# EAGLE design BattleBits_V4 (EAGLE 9.6.2)
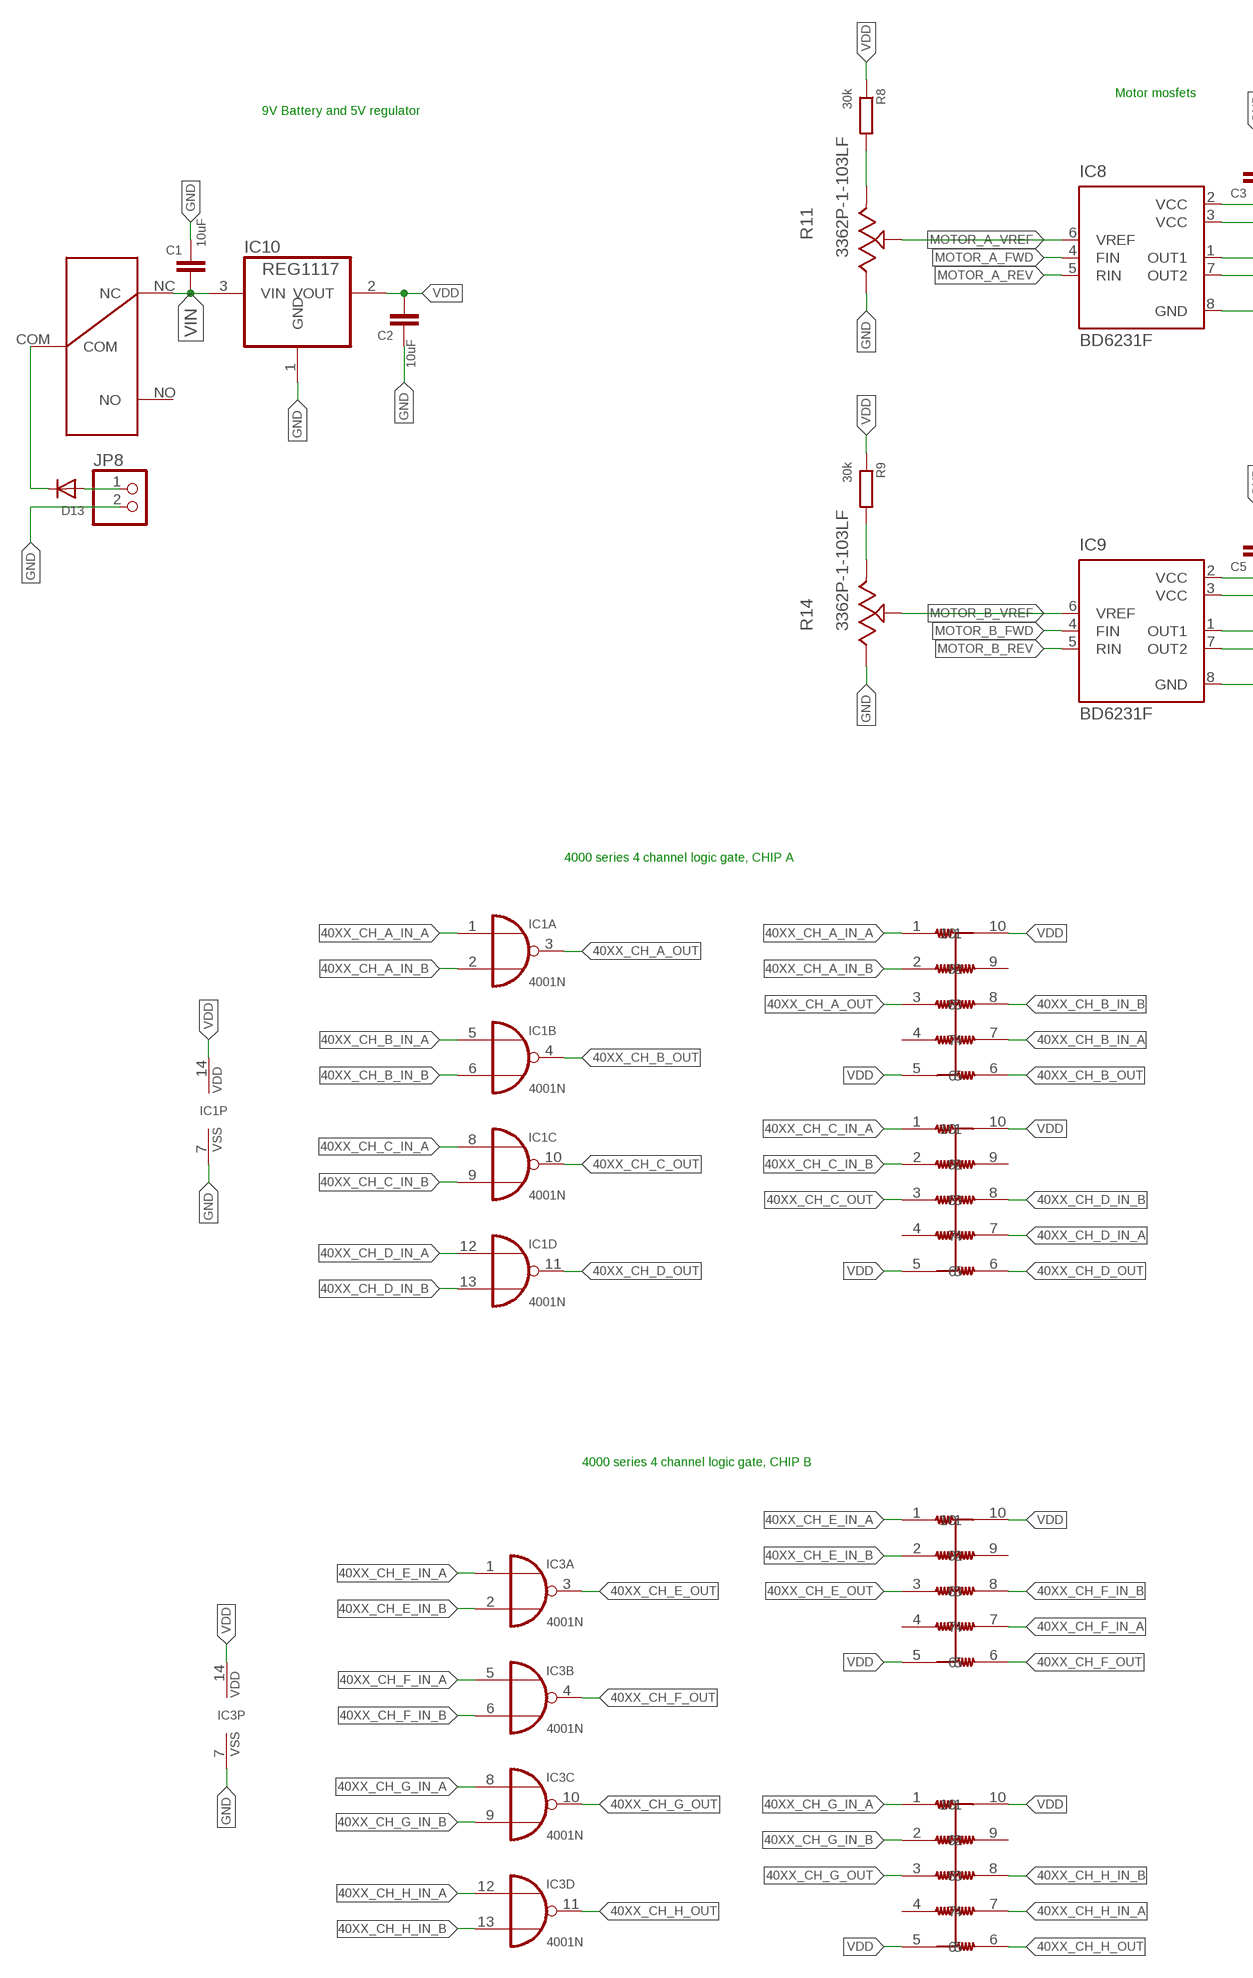
[diagram p0: schematic, sheet 1, part 1 of 2]
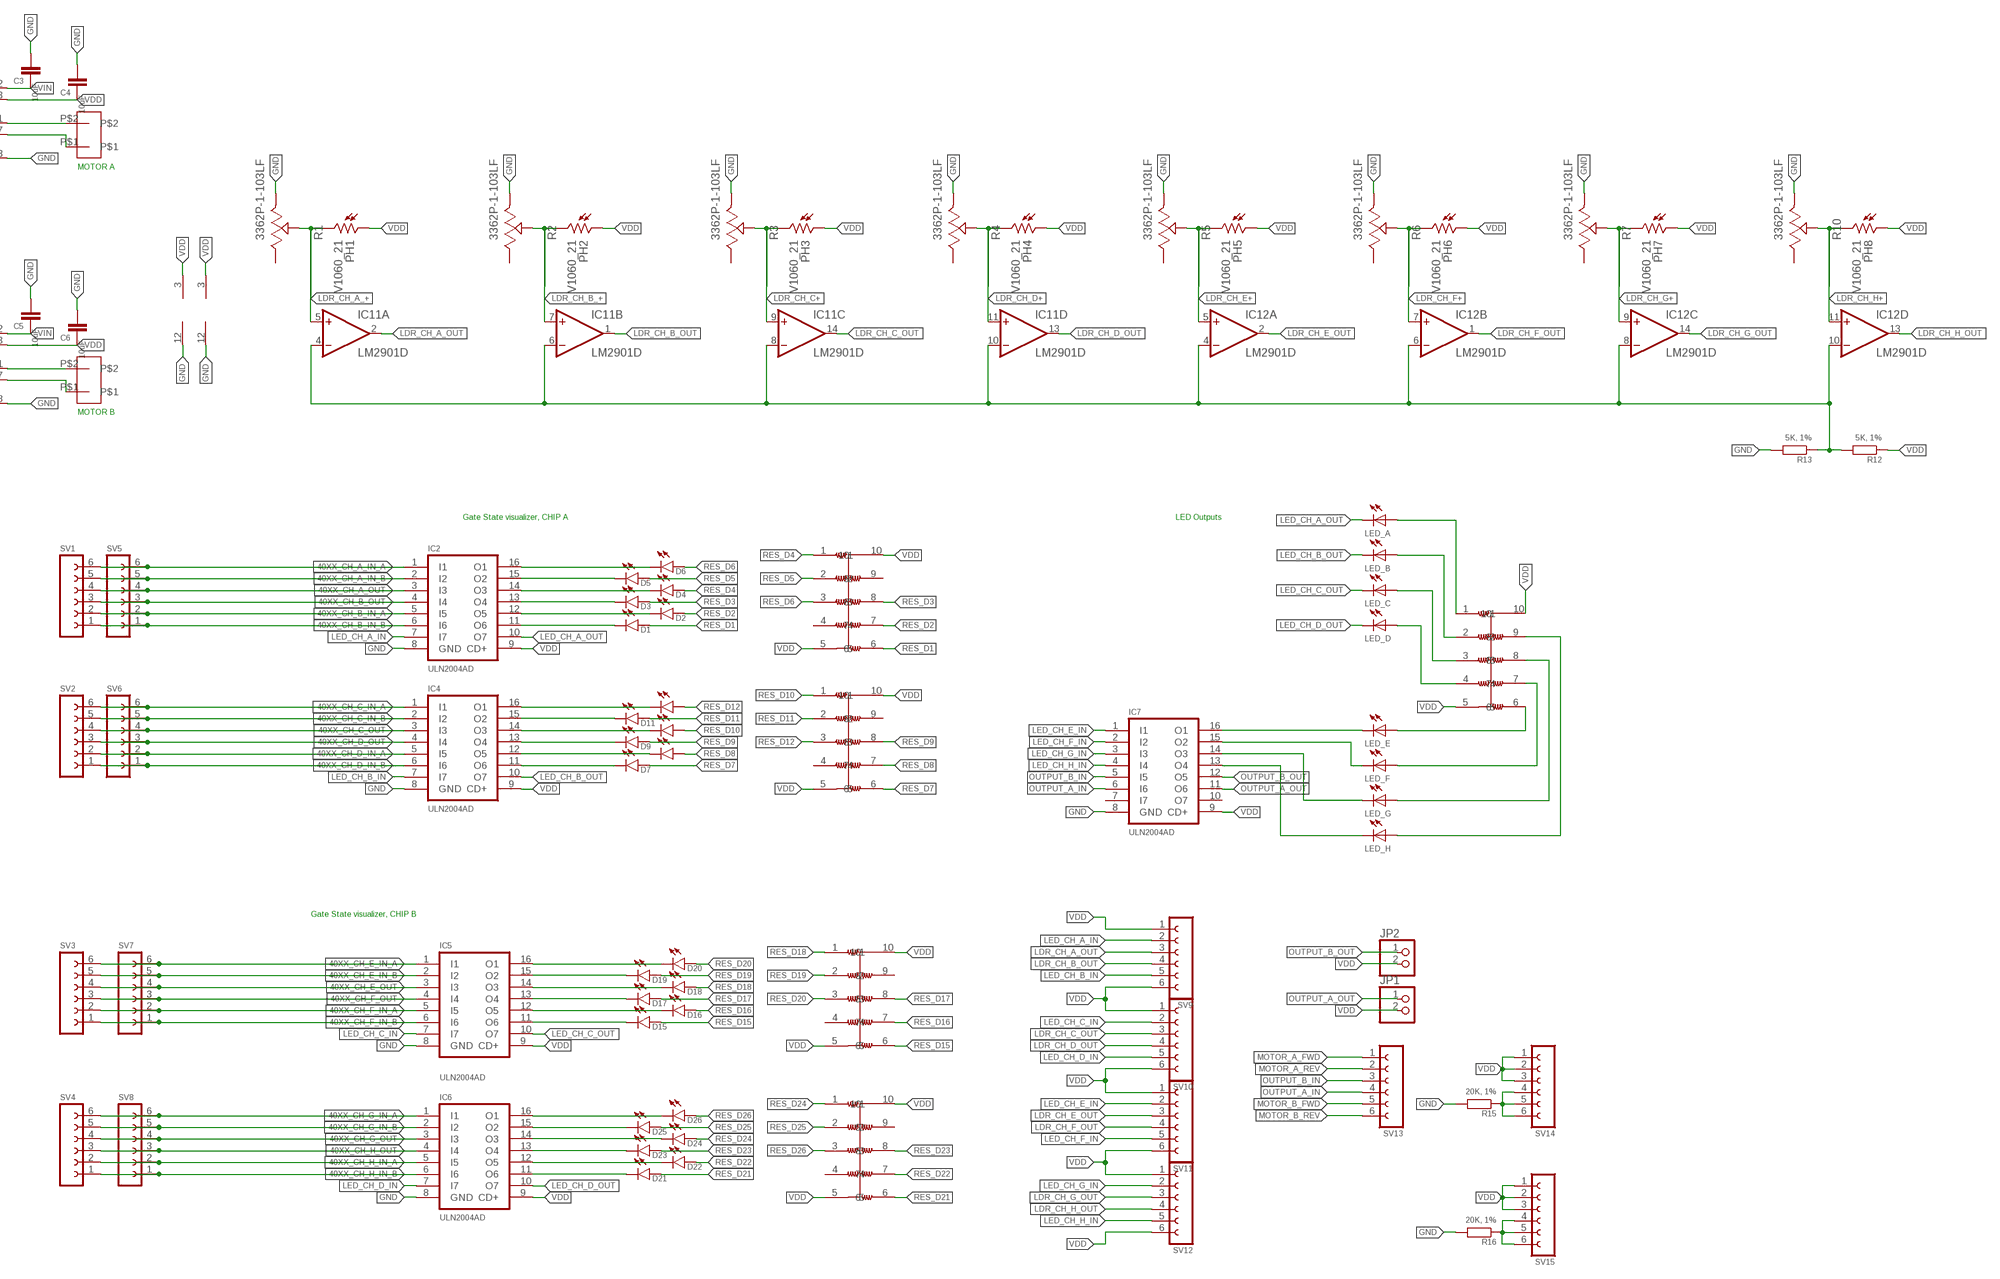
[diagram p1: schematic, sheet 1, part 2 of 2]

## Parts
C1  10uF  C-EUC3216  [C3216]
C2  10uF  C-EUC3216  [C3216]
C3  10uF  C-EUC3216  [C3216]
C4  10uF  C-EUC3216  [C3216]
C5  10uF  C-EUC3216  [C3216]
C6  10uF  C-EUC3216  [C3216]
D1  LED1206  [LED-1206]
D2  LED1206  [LED-1206]
D3  LED1206  [LED-1206]
D4  LED1206  [LED-1206]
D5  LED1206  [LED-1206]
D6  LED1206  [LED-1206]
D7  LED1206  [LED-1206]
D8  LED1206  [LED-1206]
D9  LED1206  [LED-1206]
D10  LED1206  [LED-1206]
D11  LED1206  [LED-1206]
D12  LED1206  [LED-1206]
D13  DIODESMA  [SMADIODE]
D15  LED1206  [LED-1206]
D16  LED1206  [LED-1206]
D17  LED1206  [LED-1206]
D18  LED1206  [LED-1206]
D19  LED1206  [LED-1206]
D20  LED1206  [LED-1206]
D21  LED1206  [LED-1206]
D22  LED1206  [LED-1206]
D23  LED1206  [LED-1206]
D24  LED1206  [LED-1206]
D25  LED1206  [LED-1206]
D26  LED1206  [LED-1206]
IC1  4001N  [DIL14]
IC2  ULN2004AD  [SO16]
IC3  4001N  [DIL14]
IC4  ULN2004AD  [SO16]
IC5  ULN2004AD  [SO16]
IC6  ULN2004AD  [SO16]
IC7  ULN2004AD  [SO16]
IC8  BD6231F  [SOP8]
IC9  BD6231F  [SOP8]
IC10  REG1117  [SOT223]
IC11  LM2901D  [SO14]
IC12  LM2901D  [SO14]
JP1  PINHD-1X2  [1X02]
JP2  PINHD-1X2  [1X02]
JP8  PINHD-1X2  [1X02]
LED_A  LED5MM  [LED5MM]
LED_B  LED5MM  [LED5MM]
LED_C  LED5MM  [LED5MM]
LED_D  LED5MM  [LED5MM]
LED_E  LED5MM  [LED5MM]
LED_F  LED5MM  [LED5MM]
LED_G  LED5MM  [LED5MM]
LED_H  LED5MM  [LED5MM]
PH1  V1060_21  [TO-5_V10]
PH2  V1060_21  [TO-5_V10]
PH3  V1060_21  [TO-5_V10]
PH4  V1060_21  [TO-5_V10]
PH5  V1060_21  [TO-5_V10]
PH6  V1060_21  [TO-5_V10]
PH7  V1060_21  [TO-5_V10]
PH8  V1060_21  [TO-5_V10]
R1  3362P-1-103LF  [3362P-1-103LF]
R2  3362P-1-103LF  [3362P-1-103LF]
R3  3362P-1-103LF  [3362P-1-103LF]
R4  3362P-1-103LF  [3362P-1-103LF]
R5  3362P-1-103LF  [3362P-1-103LF]
R6  3362P-1-103LF  [3362P-1-103LF]
R7  3362P-1-103LF  [3362P-1-103LF]
R8  30k  R-EU_R3216  [R3216]
R9  30k  R-EU_R3216  [R3216]
R10  3362P-1-103LF  [3362P-1-103LF]
R11  3362P-1-103LF  [3362P-1-103LF]
R12  5K, 1%  R-EU_R3216  [R3216]
R13  5K, 1%  R-EU_R3216  [R3216]
R14  3362P-1-103LF  [3362P-1-103LF]
R15  20K, 1%  R-EU_R3216  [R3216]
R16  20K, 1%  R-EU_R3216  [R3216]
SV1  FE06-1  [FE06]
SV2  FE06-1  [FE06]
SV3  FE06-1  [FE06]
SV4  FE06-1  [FE06]
SV5  FE06-1  [FE06]
SV6  FE06-1  [FE06]
SV7  FE06-1  [FE06]
SV8  FE06-1  [FE06]
SV9  FE06-1  [FE06]
SV10  FE06-1  [FE06]
SV11  FE06-1  [FE06]
SV12  FE06-1  [FE06]
SV13  FE06-1  [FE06]
SV14  FE06-1  [FE06]
SV15  FE06-1  [FE06]
U$1  MOTOR  [GEARMOTOR]
U$2  MOTOR  [GEARMOTOR]
U$3  10K  EXBA_10P  [EXBA]
U$4  330  EXBA_10P  [EXBA]
U$5  10K  EXBA_10P  [EXBA]
U$6  10K  EXBA_10P  [EXBA]
U$7  SLIDE_SWITCH  [SLIDE_SWITCH]
U$9  10K  EXBA_10P  [EXBA]
U$10  10K  EXBA_10P  [EXBA]
U$11  10K  EXBA_10P  [EXBA]
U$19  10K  EXBA_10P  [EXBA]
U$20  10K  EXBA_10P  [EXBA]

## Nets
2V5_REF: IC11.4(A:-IN) IC11.6(B:-IN) IC11.8(C:-IN) IC11.10(D:-IN) IC12.4(A:-IN) IC12.6(B:-IN) IC12.8(C:-IN) IC12.10(D:-IN) R12.2 R13.1
40XX_CH_A_IN_A [SIGNAL]: IC1.1(A:I0) IC2.1(I1) SV1.6 SV5.6 U$3.1
40XX_CH_A_IN_B [SIGNAL]: IC1.2(A:I1) IC2.2(I2) SV1.5 SV5.5 U$3.2
40XX_CH_A_OUT [SIGNAL]: IC1.3(A:O) IC2.3(I3) SV1.4 SV5.4 U$3.3
40XX_CH_B_IN_A [SIGNAL]: IC1.5(B:I0) IC2.5(I5) SV1.2 SV5.2 U$3.7
40XX_CH_B_IN_B [SIGNAL]: IC1.6(B:I1) IC2.6(I6) SV1.1 SV5.1 U$3.8
40XX_CH_B_OUT [SIGNAL]: IC1.4(B:O) IC2.4(I4) SV1.3 SV5.3 U$3.6
40XX_CH_C_IN_A [SIGNAL]: IC1.8(C:I0) IC4.1(I1) SV2.6 SV6.6 U$10.1
40XX_CH_C_IN_B [SIGNAL]: IC1.9(C:I1) IC4.2(I2) SV2.5 SV6.5 U$10.2
40XX_CH_C_OUT [SIGNAL]: IC1.10(C:O) IC4.3(I3) SV2.4 SV6.4 U$10.3
40XX_CH_D_IN_A [SIGNAL]: IC1.12(D:I0) IC4.5(I5) SV2.2 SV6.2 U$10.7
40XX_CH_D_IN_B [SIGNAL]: IC1.13(D:I1) IC4.6(I6) SV2.1 SV6.1 U$10.8
40XX_CH_D_OUT [SIGNAL]: IC1.11(D:O) IC4.4(I4) SV2.3 SV6.3 U$10.6
40XX_CH_E_IN_A [SIGNAL]: IC3.1(A:I0) IC5.1(I1) SV3.6 SV7.6 U$11.1
40XX_CH_E_IN_B [SIGNAL]: IC3.2(A:I1) IC5.2(I2) SV3.5 SV7.5 U$11.2
40XX_CH_E_OUT [SIGNAL]: IC3.3(A:O) IC5.3(I3) SV3.4 SV7.4 U$11.3
40XX_CH_F_IN_A [SIGNAL]: IC3.5(B:I0) IC5.5(I5) SV3.2 SV7.2 U$11.7
40XX_CH_F_IN_B [SIGNAL]: IC3.6(B:I1) IC5.6(I6) SV3.1 SV7.1 U$11.8
40XX_CH_F_OUT [SIGNAL]: IC3.4(B:O) IC5.4(I4) SV3.3 SV7.3 U$11.6
40XX_CH_G_IN_A [SIGNAL]: IC3.8(C:I0) IC6.1(I1) SV4.6 SV8.6 U$20.1
40XX_CH_G_IN_B [SIGNAL]: IC3.9(C:I1) IC6.2(I2) SV4.5 SV8.5 U$20.2
40XX_CH_G_OUT [SIGNAL]: IC3.10(C:O) IC6.3(I3) SV4.4 SV8.4 U$20.3
40XX_CH_H_IN_A [SIGNAL]: IC3.12(D:I0) IC6.5(I5) SV4.2 SV8.2 U$20.7
40XX_CH_H_IN_B [SIGNAL]: IC3.13(D:I1) IC6.6(I6) SV4.1 SV8.1 U$20.8
40XX_CH_H_OUT [SIGNAL]: IC3.11(D:O) IC6.4(I4) SV4.3 SV8.3 U$20.6
GND: C1.1 C2.1 C3.2 C4.2 C5.2 C6.2 IC1.7(P:VSS) IC2.8(GND) IC3.7(P:VSS) IC4.8(GND) IC5.8(GND) IC6.8(GND) IC7.8(GND) IC8.8(GND) IC9.8(GND) IC10.1(GND) IC11.12(P:V-) IC12.12(P:V-) JP8.2 R1.1 R2.1 R3.1 R4.1 R5.1 R6.1 R7.1 R10.1 R11.3 R13.2 R14.3 R15.2 R16.2
LDR_CH_A_+ [SIGNAL]: IC11.5(A:+IN) PH1.2 R1.2
LDR_CH_A_OUT [SIGNAL]: IC11.2(A:OUT) SV9.3
LDR_CH_B_+ [SIGNAL]: IC11.7(B:+IN) PH2.2 R2.2
LDR_CH_B_OUT: IC11.1(B:OUT) SV9.4
LDR_CH_C+ [SIGNAL]: IC11.9(C:+IN) PH3.2 R3.2
LDR_CH_C_OUT [SIGNAL]: IC11.14(C:OUT) SV10.3
LDR_CH_D+ [SIGNAL]: IC11.11(D:+IN) PH4.2 R4.2
LDR_CH_D_OUT: IC11.13(D:OUT) SV10.4
LDR_CH_E+ [SIGNAL]: IC12.5(A:+IN) PH5.2 R5.2
LDR_CH_E_OUT [SIGNAL]: IC12.2(A:OUT) SV11.3
LDR_CH_F+ [SIGNAL]: IC12.7(B:+IN) PH6.2 R6.2
LDR_CH_F_OUT: IC12.1(B:OUT) SV11.4
LDR_CH_G+ [SIGNAL]: IC12.9(C:+IN) PH7.2 R7.2
LDR_CH_G_OUT [SIGNAL]: IC12.14(C:OUT) SV12.3
LDR_CH_H+ [SIGNAL]: IC12.11(D:+IN) PH8.2 R10.2
LDR_CH_H_OUT: IC12.13(D:OUT) SV12.4
LED_CH_A_IN [SIGNAL]: IC2.7(I7) SV9.2
LED_CH_A_OUT: IC2.10(O7) LED_A.K(C)
LED_CH_B_IN [SIGNAL]: IC4.7(I7) SV9.5
LED_CH_B_OUT: IC4.10(O7) LED_B.K(C)
LED_CH_C_IN [SIGNAL]: IC5.7(I7) SV10.2
LED_CH_C_OUT: IC5.10(O7) LED_C.K(C)
LED_CH_D_IN [SIGNAL]: IC6.7(I7) SV10.5
LED_CH_D_OUT: IC6.10(O7) LED_D.K(C)
LED_CH_E_IN [SIGNAL]: IC7.1(I1) SV11.2
LED_CH_F_IN [SIGNAL]: IC7.2(I2) SV11.5
LED_CH_G_IN [SIGNAL]: IC7.3(I3) SV12.2
LED_CH_H_IN [SIGNAL]: IC7.4(I4) SV12.5
MOTOR_A_FWD [SIGNAL]: IC8.4(FIN) SV13.1
MOTOR_A_REV: IC8.5(RIN) SV13.2
MOTOR_A_VREF: IC8.6(VREF) R11.2
MOTOR_B_FWD: IC9.4(FIN) SV13.5
MOTOR_B_REV [SIGNAL]: IC9.5(RIN) SV13.6
MOTOR_B_VREF: IC9.6(VREF) R14.2
N$1: R8.2 R11.1
N$3: R9.2 R14.1
N$5: D6.C IC2.16(O1)
N$6: IC9.1(OUT1) U$2.P$2
N$7: IC9.7(OUT2) U$2.P$1
N$8: D5.C IC2.15(O2)
N$9: D4.C IC2.14(O3)
N$10: D3.C IC2.13(O4)
N$11: D2.C IC2.12(O5)
N$12: D1.C IC2.11(O6)
N$13: D26.C IC6.16(O1)
N$14: D12.C IC4.16(O1)
N$15: D11.C IC4.15(O2)
N$16: D10.C IC4.14(O3)
N$17: D9.C IC4.13(O4)
N$18: D8.C IC4.12(O5)
N$19: D7.C IC4.11(O6)
N$20: R15.1 SV14.4 SV14.5 SV14.6
N$21: D24.C IC6.14(O3)
N$23: D20.C IC5.16(O1)
N$24: R16.1 SV15.4 SV15.5 SV15.6
N$25: D19.C IC5.15(O2)
N$27: D18.C IC5.14(O3)
N$29: D17.C IC5.13(O4)
N$31: D16.C IC5.12(O5)
N$32: D15.C IC5.11(O6)
N$33: D25.C IC6.15(O2)
N$34: D23.C IC6.13(O4)
N$35: D22.C IC6.12(O5)
N$38: D21.C IC6.11(O6)
N$44: LED_A.A U$4.1
N$45: LED_B.A U$4.2
N$46: IC7.16(O1) LED_E.K(C)
N$47: IC7.15(O2) LED_F.K(C)
N$48: IC7.14(O3) LED_G.K(C)
N$49: IC7.13(O4) LED_H.K(C)
N$50: LED_C.A U$4.3
N$51: LED_D.A U$4.4
N$52: LED_E.A U$4.6
N$53: LED_F.A U$4.7
N$54: LED_G.A U$4.8
N$55: LED_H.A U$4.9
N$61: D13.A JP8.1
N$82: IC8.1(OUT1) U$1.P$2
N$83: IC8.7(OUT2) U$1.P$1
OUTPUT_A_IN: IC7.6(I6) SV13.4
OUTPUT_A_OUT: IC7.11(O6) JP1.1
OUTPUT_B_IN: IC7.5(I5) SV13.3
OUTPUT_B_OUT: IC7.12(O5) JP2.1
RES_D1: D1.A U$19.6
RES_D2: D2.A U$19.7
RES_D3: D3.A U$19.8
RES_D4: D4.A U$19.1
RES_D5: D5.A U$19.2
RES_D6: D6.A U$19.3
RES_D7: D7.A U$5.6
RES_D8: D8.A U$5.7
RES_D9: D9.A U$5.8
RES_D10: D10.A U$5.1
RES_D11: D11.A U$5.2
RES_D12: D12.A U$5.3
RES_D15: D15.A U$6.6
RES_D16: D16.A U$6.7
RES_D17: D17.A U$6.8
RES_D18: D18.A U$6.1
RES_D19: D19.A U$6.2
RES_D20: D20.A U$6.3
RES_D21: D21.A U$9.6
RES_D22: D22.A U$9.7
RES_D23: D23.A U$9.8
RES_D24: D24.A U$9.1
RES_D25: D25.A U$9.2
RES_D26: D26.A U$9.3
VBAT: D13.C U$7.COM
VDD: C2.2 C4.1 C6.1 IC1.14(P:VDD) IC2.9(CD+) IC3.14(P:VDD) IC4.9(CD+) IC5.9(CD+) IC6.9(CD+) IC7.9(CD+) IC8.3(VCC) IC9.3(VCC) IC10.2(VOUT) IC11.3(P:V+) IC12.3(P:V+) JP1.2 JP2.2 PH1.1 PH2.1 PH3.1 PH4.1 PH5.1 PH6.1 PH7.1 PH8.1 R8.1 R9.1 R12.1 SV9.1 SV9.6 SV10.1 SV10.6 SV11.1 SV11.6 SV12.1 SV12.6 SV14.1 SV14.2 SV14.3 SV15.1 SV15.2 SV15.3 U$3.5 U$3.10 U$4.5 U$4.10 U$5.5 U$5.10 U$6.5 U$6.10 U$9.5 U$9.10 U$10.5 U$10.10 U$11.5 U$11.10 U$19.5 U$19.10 U$20.5 U$20.10
VIN: C1.2 C3.1 C5.1 IC8.2(VCC) IC9.2(VCC) IC10.3(VIN) U$7.NC
Unconnected: IC7.7(I7) IC7.10(O7) R1.3 R2.3 R3.3 R4.3 R5.3 R6.3 R7.3 R10.3 U$3.4 U$3.9 U$5.4 U$5.9 U$6.4 U$6.9 U$7.NO U$9.4 U$9.9 U$10.4 U$10.9 U$11.4 U$11.9 U$19.4 U$19.9 U$20.4 U$20.9

## Notes on the sheet
- Motor mosfets
- 9V Battery and 5V regulator
- MOTOR A
- MOTOR B
- 4000 series 4 channel logic gate, CHIP A | Gate State visualizer, CHIP A | LED Outputs
- 4000 series 4 channel logic gate, CHIP B | Gate State visualizer, CHIP B

## Library data of the parts
C1-C6 = rcl:C-EU: CAPACITOR, European symbol; SPICEPREFIX: C
D1-D12 D15-D26 = SparkFun-LED:LED: LED (Generic) Standard schematic elements and footprints for 5mm, 3mm, 1206, and 0603 sized LEDs. Generic LEDs with no color specified.
D13 = adafruit:DIODE: Diode SMADIODE - SMA Surface Mount Package 20V 1A Schottky Diode Digikey: 641-1014-6-ND DO-1N4148 - Through Hole Small Current Diode SOD-123 20V 1 A (.5mV Vf) Schottky Diode - Digikey: MBRX120TPMSCT-ND SOD-323 10V 570mA (.38mV Vf, 3ns) Schottky Diode - Digikey: ZLLS410CT-ND SOD-523 30V 30mA Schottky Diode (RB751S-40TE61) - Digikey: RB751S-40TE61CT-ND SOT23-R/W - SOT23 Package (R = Solder Paste/Reflow Ovens, W = Hand-Soldering) BAT54Film 40V 300mA - Digikey: 497-7162-1-ND
IC1 IC3 = 40xx:4001: Quad 2-input NOR
IC2 IC4-IC7 = uln-udn:ULN2004A: DRIVER ARRAY
IC8 IC9 = rohm:BD623*F: H-bridge driver for brush motors Source: http://www.rohm.com/products/databook/motor/pdf/bd623x_series-e.pdf; MPN: BD6231F-E2; OC_FARNELL: 1716265; OC_NEWARK: 15R0530
IC10 = burr-brown:REG1117: 800mA and 1A Low Dropout (LDO) Positive Regulator 1.8V, 2.5V, 2.85V, 3.3V, 5V, and Adj; MPN: REG1117; OC_FARNELL: 1097566; OC_NEWARK: 14P6981
IC11 IC12 = linear:LM2901: COMPARATOR
JP1 JP2 JP8 = pinhead:PINHD-1X2: PIN HEADER
LED_A LED_B LED_C LED_D LED_E LED_F LED_G LED_H = adafruit:LED: LED OSRAM: - CHIPLED LG R971, LG N971, LY N971, LG Q971, LY Q971, LO R971, LY R971 LH N974, LH R974 LS Q976, LO Q976, LY Q976 LO Q996 - Hyper CHIPLED LW Q18S LB Q993, LB Q99A, LB R99A - SideLED LS A670, LO A670, LY A670, LG A670, LP A670 LB A673, LV A673, LT A673, LW A673 LH A674 LY A675 LS A676, LA A676, LO A676, LY A676, LW A676 LS A679, LY A679, LG A679 - Hyper Micro SIDELED® LS Y876, LA Y876, LO Y876, LY Y876 LT Y87S - SmartLED LW L88C, LW L88S LB L89C, LB L89S, LG L890 LS L89K, LO L89K, LY L89K LS L896, LA L896, LO L896, LY L896 - TOPLED LS T670, LO T670, LY T670, LG T670, LP T670 LSG T670, LSP T670, LSY T670, LOP T670, LYG T670 LG T671, LOG T671, LSG T671 LB T673, LV T673, LT T673, LW T673 LH T674 LS T676, LA T676, LO T676, LY T676, LB T676, LH T676, LSB T676, LW T676 LB T67C, LV T67C, LT T67C, LS T67K, LO T67K, LY T67K, LW E67C LS E67B, LA E67B, LO E67B, LY E67B, LB E67C, LV E67C, LT E67C LW T67C LS T679, LY T679, LG T679 LS T770, LO T770, LY T770, LG T770, LP T770 LB T773, LV T773, LT T773, LW T773 LH T774 LS E675, LA E675, LY E675, LS T675 LS T776, LA T776, LO T776, LY T776, LB T776 LHGB T686 LT T68C, LB T68C - Hyper Mini TOPLED® LB M676 - Mini TOPLED Santana® LG M470 LS M47K, LO M47K, LY M47K Source: http://www.osram.convergy.de/
PH1-PH8 = photo-elements:?1060*: Sensor Street Light control Source: http://optoelectronics.perkinelmer.com/content/Datasheets/DTS_PhotocellsB1060.pdf
R1-R7 R10 R11 R14 = Potentiometer_Trimmers:3362P-1-103LF: TRIMMER 10K OHM 0.5W PC PIN TOP Manufacturer's datasheet <https://www.bourns.com/docs/Product-Datasheets/3362.pdf>; CREATED_PN: PCBLayout.com; DIGIKEY_PN: 3362P-103LF-ND; MANUFACTURER: Bourns Inc.; MPN: 3362P-1-103LF
R8 R9 R12 R13 R15 R16 = rcl:R-EU_: RESISTOR, European symbol; SPICEPREFIX: R
SV1-SV15 = con-lsta:FE06-1: FEMALE HEADER; OC_FARNELL: unknown; OC_NEWARK: unknown
U$1 U$2 = gearmotor:MOTOR
U$3-U$6 U$9-U$11 U$19 U$20 = EXBA:EXBA_10P
U$7 = SlideSwitch:SLIDE_SWITCH

## Net classes
0 PWR: width 0.305 mm, drill 0.3 mm, clearance 0.152 mm
1 SIGNAL: width 0.305 mm, drill 0.3 mm, clearance 0.152 mm

## Board
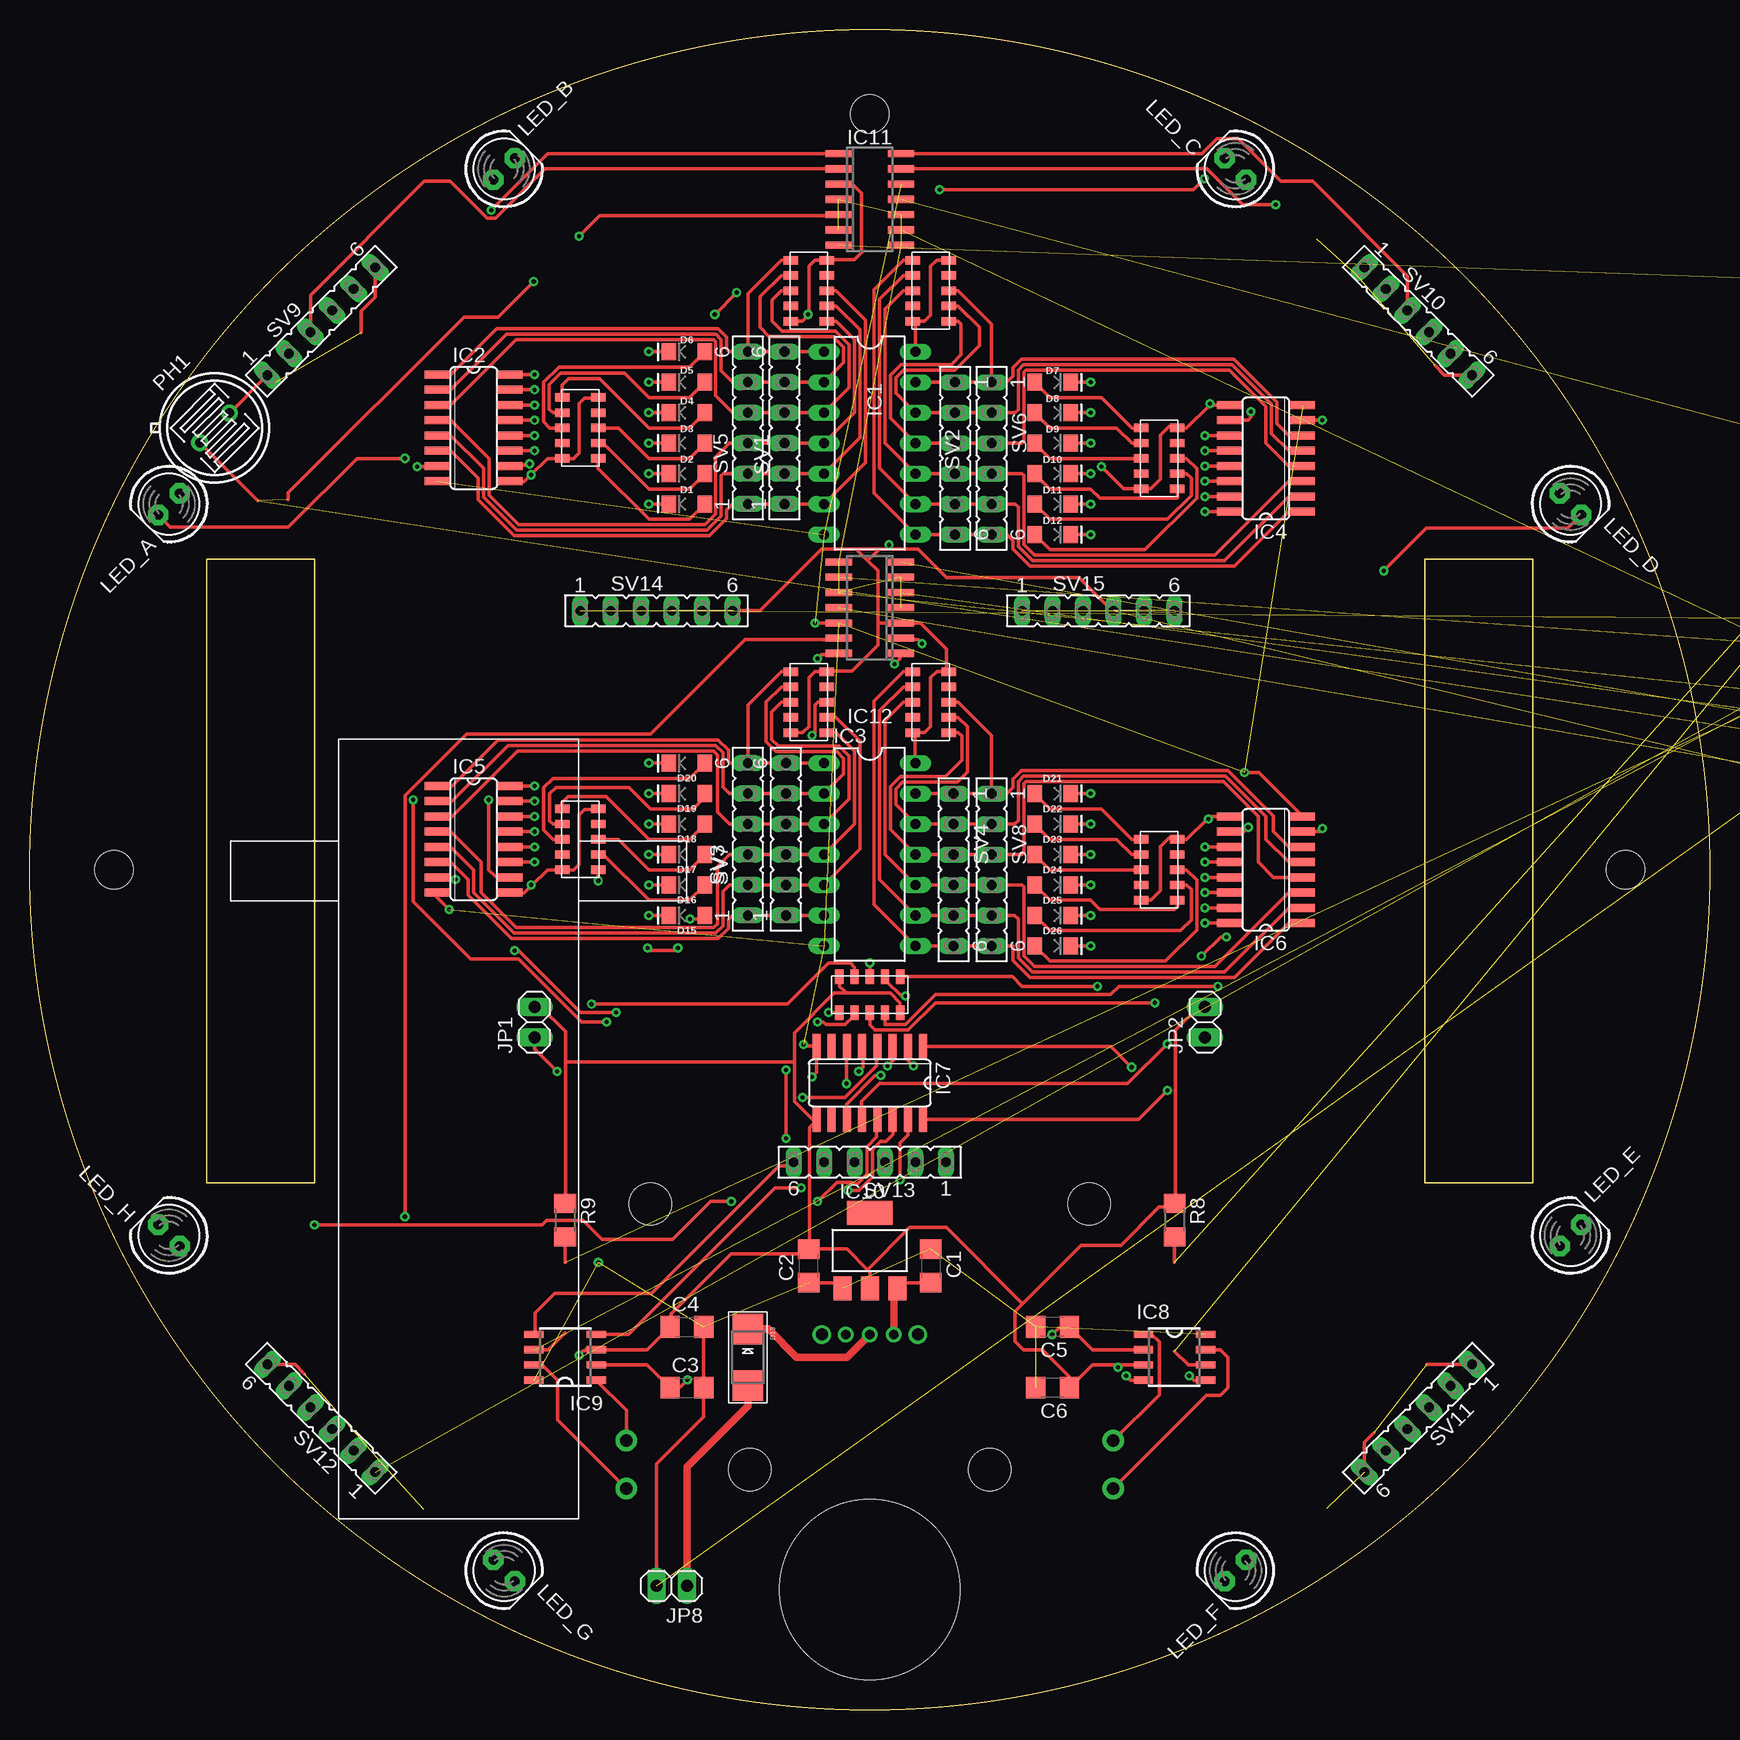
[diagram p2: board, top side]
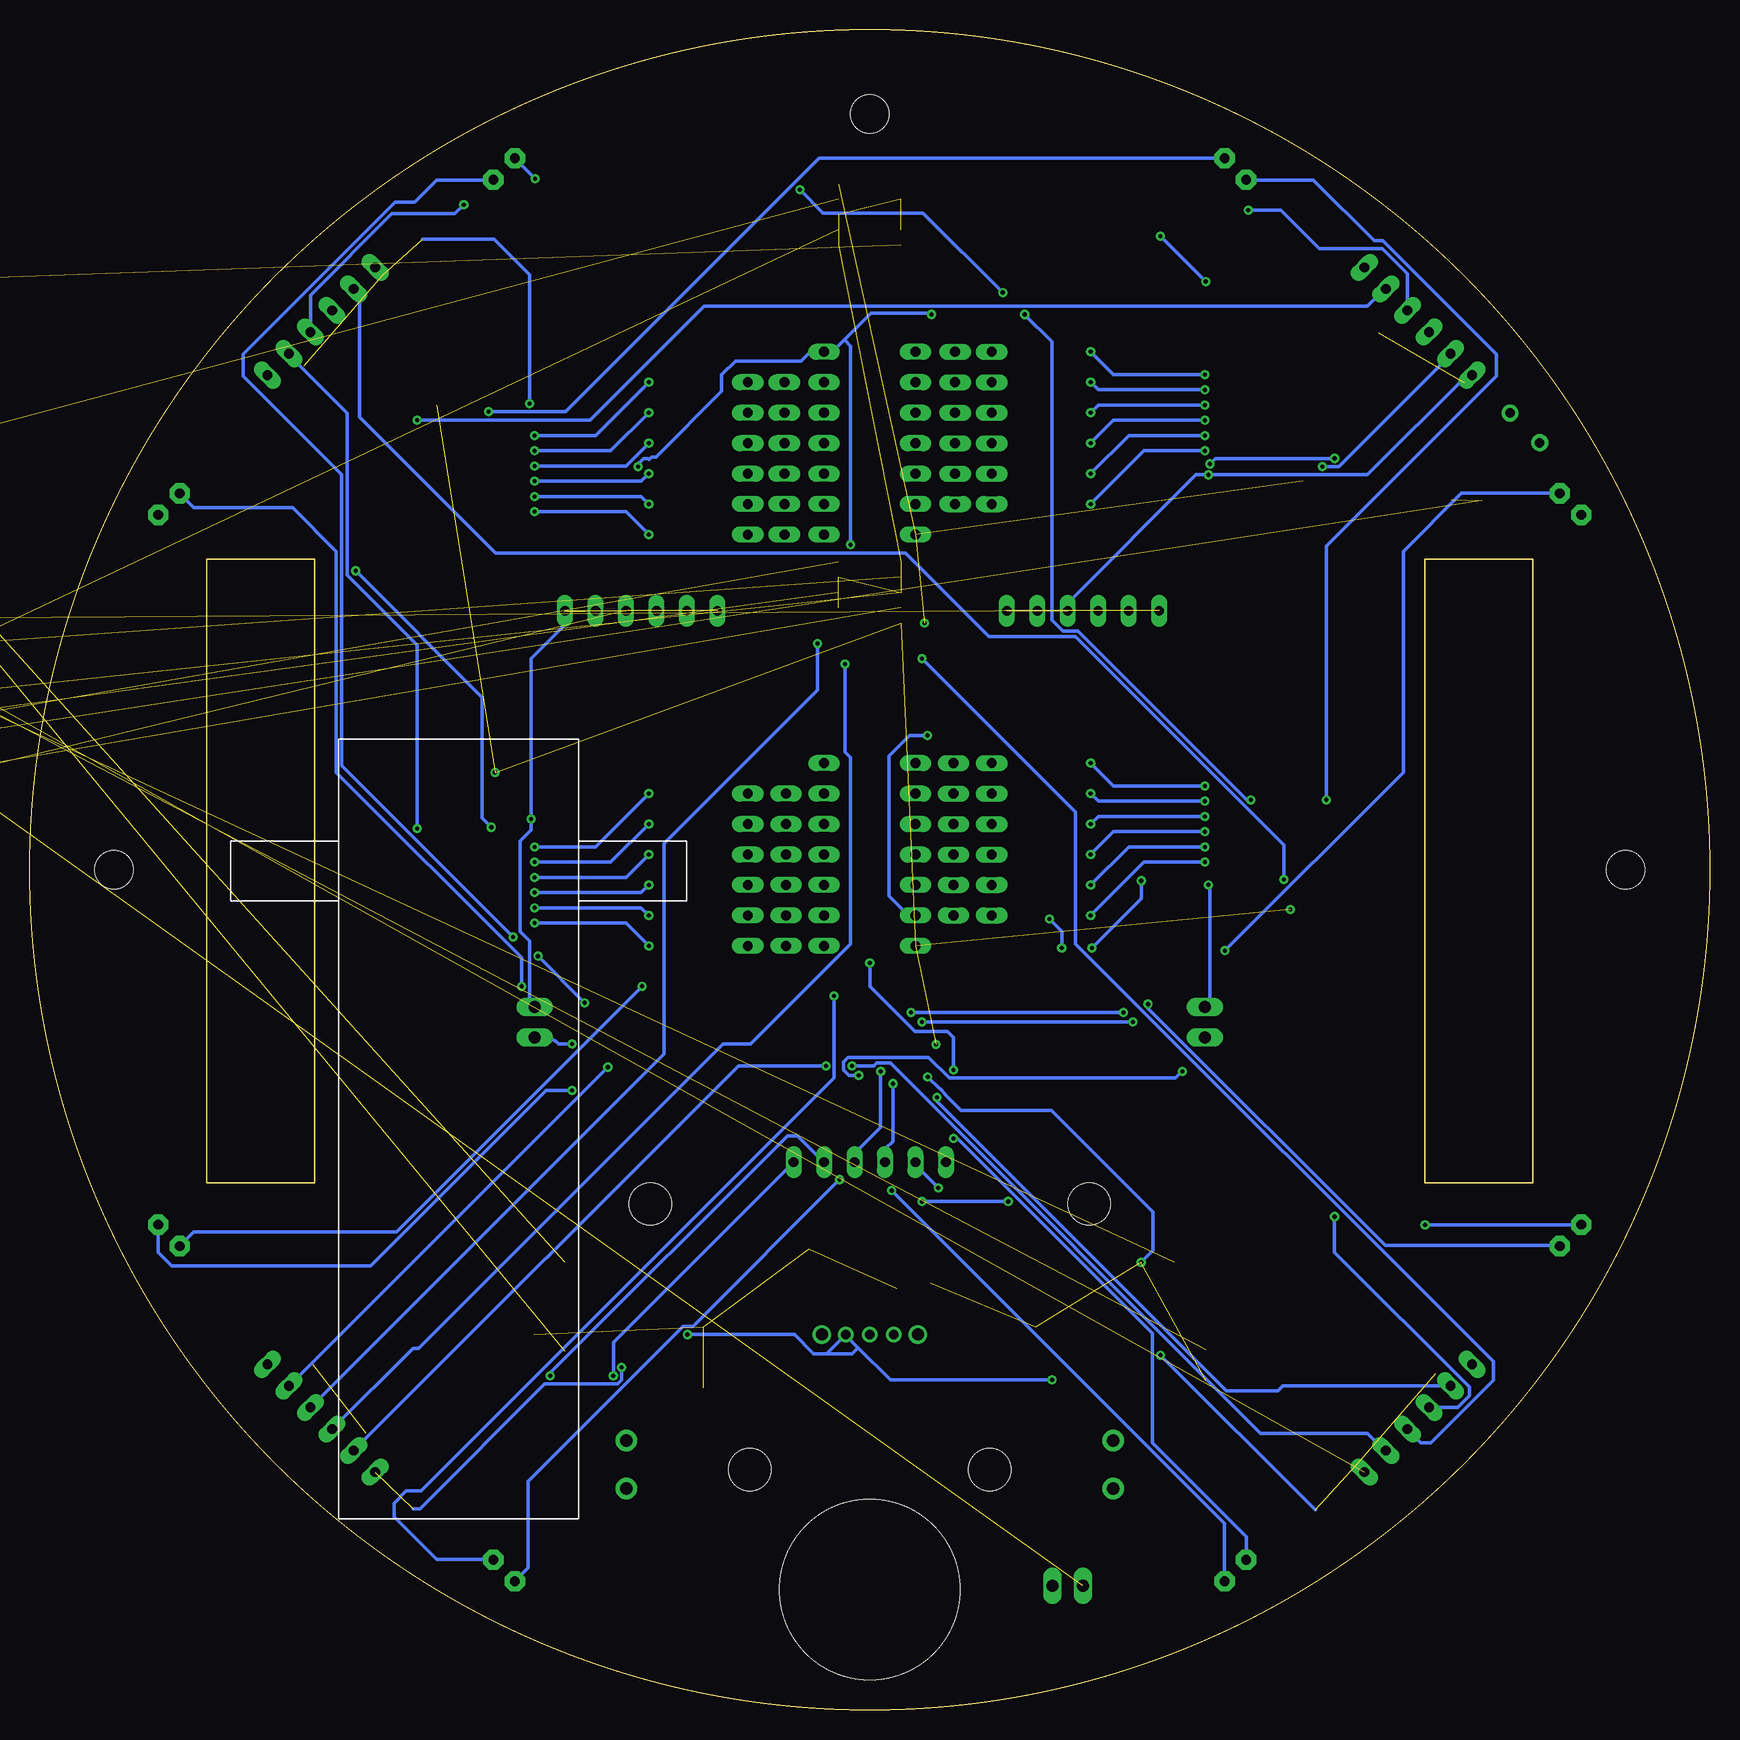
[diagram p3: board, bottom side, seen from below]

Size 140 x 140 mm. Coordinates in mm from the lower left corner, seen from the top.
Outline: circle at 70,70 radius 70
Copper layers (1*16): Top 0.035mm / dielectric 1.5mm / Bottom 0.035mm
Design rules "default *": minimum track width 6mil, minimum drill 0.35mm, track to track 6mil, track to pad 6mil, pad to pad 6mil, via to via 6mil, smd to smd 6mil, copper to edge 40mil, drill to drill 6mil, minimum pad ring 10mil, minimum via ring 8mil, stop-mask expansion 4mil, vias tented up to drill 0mil, thermal gap 10mil
Holes 15 mm at 70,10
Holes 3.5 mm at 60,20 80,20
Holes 3.2 mm at 7,70 133,70 70,133

### Footprints (pad centres in the part's own frame; a part is rotated, then mirrored left to right if it is on the bottom)
C3216 = smd 1.6 x 1.8: 1 -1.4,0; 2 1.4,0
LED-1206 = smd 1.2 x 1.4: A -1.5,0; C 1.5,0
SMADIODE = smd 2.54 x 2.54: A 2.349,0; C -2.349,0
DIL14 = drill 0.813 long: 1 -7.62,-3.81; 2 -5.08,-3.81; 3 -2.54,-3.81; 4 0,-3.81; 5 2.54,-3.81; 6 5.08,-3.81; 7 7.62,-3.81; 8 7.62,3.81; 9 5.08,3.81; 10 2.54,3.81; 11 0,3.81; 12 -2.54,3.81; 13 -5.08,3.81; 14 -7.62,3.81
SO16 = smd 0.66 x 2.032: 1 -4.445,-3.073; 2 -3.175,-3.073; 3 -1.905,-3.073; 4 -0.635,-3.073; 5 0.635,-3.073; 6 1.905,-3.073; 7 3.175,-3.073; 8 4.445,-3.073; 9 4.445,3.073; 10 3.175,3.073; 11 1.905,3.073; 12 0.635,3.073; 13 -0.635,3.073; 14 -1.905,3.073; 15 -3.175,3.073; 16 -4.445,3.073
SOP8 = smd 0.6 x 1.6: 1 -1.905,-2.6; 2 -0.635,-2.6; 3 0.635,-2.6; 4 1.905,-2.6; 5 1.905,2.6; 6 0.635,2.6; 7 -0.635,2.6; 8 -1.905,2.6
SOT223 = smd 1.499 x 2.007: 1 -2.261,-3.15; 2 0.025,-3.15; 3 2.311,-3.15 | smd 3.81 x 2.007: 4 0,3.15
SO14 = smd 0.6 x 2.2: 1 -3.81,-2.6; 2 -2.54,-2.6; 3 -1.27,-2.6; 4 0,-2.6; 5 1.27,-2.6; 6 2.54,-2.6; 7 3.81,-2.6; 8 3.81,2.6; 9 2.54,2.6; 10 1.27,2.6; 11 0,2.6; 12 -1.27,2.6; 13 -2.54,2.6; 14 -3.81,2.6
1X02 = drill 1.016 long: 1 -1.27,0; 2 1.27,0
LED5MM = drill 0.813 pad 1.676 octagon: A -1.27,0; K 1.27,0
TO-5_V10 = drill 0.8 pad 1.4: 1 -1.75,0; 2 1.75,0
3362P-1-103LF = drill 0.66: 1 -2.54,0; 2 0,2.54; 3 2.54,0
R3216 = smd 1.6 x 1.8: 1 -1.4,0; 2 1.4,0
FE06 = drill 0.813 long: 1 -6.35,0; 2 -3.81,0; 3 -1.27,0; 4 1.27,0; 5 3.81,0; 6 6.35,0
GEARMOTOR = drill 1.016 pad 1.778: P$1 14,-30; P$2 14,-26 | hole 3.5: 16,-6.27
EXBA = smd 0.7 x 1.2: 1 -2.54,-1.5; 2 -1.27,-1.5; 3 0,-1.5; 4 1.27,-1.5; 5 2.54,-1.5; 6 2.54,1.5; 7 1.27,1.5; 8 0,1.5; 9 -1.27,1.5; 10 -2.54,1.5
SLIDE_SWITCH = drill 0.8: COM 0,0; NC -2,0; NO 2,0 | drill 1: N.C.0 -4,0; N.C.1 4,0

### Placement (x,y rotation side)
C1  75.08,36.98 270 top
C2  64.92,36.98 90 top
C3  54.76,26.82 0 top
C4  54.76,31.9 0 top
C5  85.24,31.9 180 top
C6  85.24,26.82 180 top
D1  54.76,100.48 180 top
D2  54.76,103.02 180 top
D3  54.76,105.56 180 top
D4  54.76,108.1 180 top
D5  54.76,110.64 180 top
D6  54.76,113.18 180 top
D7  85.24,110.64 0 top
D8  85.24,108.1 0 top
D9  85.24,105.56 0 top
D10  85.24,103.02 0 top
D11  85.24,100.48 0 top
D12  85.24,97.94 0 top
D13  59.84,29.36 270 top
D15  54.76,66.19 180 top
D16  54.76,68.73 180 top
D17  54.76,71.27 180 top
D18  54.76,73.81 180 top
D19  54.76,76.35 180 top
D20  54.76,78.89 180 top
D21  85.24,76.35 0 top
D22  85.24,73.81 0 top
D23  85.24,71.27 0 top
D24  85.24,68.73 0 top
D25  85.24,66.19 0 top
D26  85.24,63.65 0 top
IC1  70,105.56 270 top
IC2  36.98,106.83 270 top
IC3  70,71.27 270 top
IC4  103.02,104.29 90 top
IC5  36.98,72.54 270 top
IC6  103.02,70 90 top
IC7  70,52.22 180 top
IC8  95.4,29.36 270 top
IC9  44.6,29.36 90 top
IC10  70,38.25 0 top
IC11  70,125.88 270 top
IC12  70,91.84 90 top
JP1  42.06,57.3 90 top
JP2  97.94,57.3 90 top
JP8  53.49,10.31 180 top
LED_A  11.58,100.48 225 top
LED_B  39.52,128.42 45 top
LED_C  100.48,128.42 135 top
LED_D  128.42,100.48 315 top
LED_E  128.42,39.52 45 top
LED_F  100.48,11.58 225 top
LED_G  39.52,11.58 315 top
LED_H  11.58,39.52 135 top
PH1  15.39,106.83 225 top
PH2  177.29,118.08 0 top  (outside the outline)
PH3  167.29,77.76 0 top  (outside the outline)
PH4  177.29,97.44 0 top  (outside the outline)
PH5  187.29,77.12 0 top  (outside the outline)
PH6  177.29,76.8 0 top  (outside the outline)
PH7  177.29,86.48 0 top  (outside the outline)
PH8  157.29,76.16 0 top  (outside the outline)
R1  195.86,71.08 0 top  (outside the outline)
R2  174.43,111.08 0 top  (outside the outline)
R3  193,111.08 0 top  (outside the outline)
R4  151.57,71.08 0 top  (outside the outline)
R5  170.14,91.08 0 top  (outside the outline)
R6  198.71,101.08 0 top  (outside the outline)
R7  197.28,91.08 0 top  (outside the outline)
R8  95.4,40.79 270 top
R9  44.6,40.79 270 top
R10  195.85,81.08 0 top  (outside the outline)
R11  164.42,111.08 0 top  (outside the outline)
R12  146.02,84.59 0 top  (outside the outline)
R13  146.02,78.24 0 top  (outside the outline)
R14  162.99,91.08 0 top  (outside the outline)
R15  151.72,90.92 0 top  (outside the outline)
R16  161.72,74.57 0 top  (outside the outline)
SV1  62.89,106.83 90 top
SV2  77.11,104.29 270 top
SV3  63.02,72.54 90 top
SV4  76.98,70 270 top
SV5  59.84,106.83 90 top
SV6  80.16,104.29 270 top
SV7  59.84,72.54 90 top
SV8  80.16,70 270 top
SV9  24.28,115.72 45 top
SV10  115.72,115.72 315 top
SV11  115.72,24.28 225 top
SV12  24.28,24.28 135 top
SV13  70,45.62 180 top
SV14  52.22,91.59 0 top
SV15  89.05,91.59 0 top
U$1  104.29,48.41 0 bottom
U$2  35.71,48.41 0 top
U$3  64.92,118.26 270 top
U$4  70,59.59 0 top
U$5  94.13,104.29 90 top
U$6  45.87,72.54 270 top
U$7  70,31.25 180 top
U$9  94.13,70 90 top
U$10  75.08,118.26 270 top
U$11  64.92,83.97 270 top
U$19  45.87,106.83 270 top
U$20  75.08,83.97 270 top

### Tracks (layer width: path | path; a pad name or v marks a point on that pad's centre or on a via)
2V5_REF  (9 unrouted)
40XX_CH_A_IN_A
  Top 0.305: U$3.1 62.63,120.8 59.84,118.01 SV5.6 | SV5.6 SV1.6 IC1.1 | IC2.1 35.08,111.28 38.9,115.1 57.37,115.1 58.08,114.38 58.08,113.42 58.32,113.18 SV5.6
40XX_CH_A_IN_B
  Top 0.305: U$3.2 62.63,119.53 60.86,117.75 60.86,115.21 61.62,114.45 66.94,114.45 67.82,113.58 67.82,112.27 IC1.2 SV1.5 SV5.5 58.57,110.64 57.62,111.59 57.62,114.2 57.18,114.64 39.71,114.64 35.08,110 IC2.2
40XX_CH_A_OUT
  Top 0.305: U$3.3 62.63,118.26 61.87,117.5 61.87,115.72 62.69,114.91 67.14,114.91 68.27,113.77 68.27,110.18 IC1.3 SV1.4 SV5.4 58.57,108.1 57.16,109.5 57.16,114.01 56.99,114.19 40.52,114.19 35.08,108.73 IC2.3
40XX_CH_B_IN_A
  Top 0.305: U$3.7 67.21,116.99 69.19,115.01 69.19,106.02 IC1.5 SV1.2 SV5.2 57.81,103.02 57.62,102.83 57.62,99.46 56.45,98.3 40.55,98.3 37.79,101.05 37.79,103.48 35.08,106.19 IC2.5
40XX_CH_B_IN_B
  Top 0.305: U$3.8 67.21,118.26 69.64,115.82 69.64,103.93 IC1.6 SV1.1 SV5.1 58.57,100.48 58.08,99.99 58.08,99.28 56.64,97.84 40.36,97.84 37.34,100.86 37.34,102.66 35.08,104.92 IC2.6
40XX_CH_B_OUT
  Top 0.305: U$3.6 67.21,115.72 68.73,114.2 68.73,108.1 IC1.4 SV1.3 SV5.3 58.32,105.56 57.16,104.41 57.16,99.65 56.26,98.75 40.74,98.75 38.25,101.24 38.25,104.29 35.08,107.47 IC2.4
40XX_CH_C_IN_A
  Top 0.305: U$10.1 72.79,120.8 70.36,118.36 70.36,101.39 IC1.8 SV2.6 SV6.6 81.43,97.94 81.92,97.45 81.92,96.73 83.36,95.3 100.38,95.3 104.92,99.84 IC4.1
40XX_CH_C_IN_B
  Top 0.305: U$10.2 72.79,119.53 70.81,117.55 70.81,103.48 IC1.9 SV2.5 SV6.5 82.12,100.48 82.38,100.23 82.38,96.92 83.55,95.76 99.57,95.76 104.92,101.11 IC4.2
40XX_CH_C_OUT
  Top 0.305: U$10.3 72.79,118.26 71.27,116.74 71.27,105.56 IC1.10 SV2.4 SV6.4 82.7,103.02 82.84,102.88 82.84,97.11 83.74,96.21 98.75,96.21 104.92,102.38 IC4.3
40XX_CH_D_IN_A
  Top 0.305: U$10.7 77.37,116.99 79.14,115.21 79.14,113.69 77.11,111.66 72.8,111.66 72.18,111.04 72.18,109.73 IC1.12 SV2.2 SV6.2 82.12,108.1 82.38,108.35 82.38,111.66 82.82,112.1 100.17,112.1 103.48,108.8 103.48,106.37 104.92,104.92 IC4.5
40XX_CH_D_IN_B
  Top 0.305: U$10.8 77.37,118.26 80.16,115.47 SV6.1 | IC1.13 SV2.1 SV6.1 | SV6.1 81.41,110.64 81.92,111.15 81.92,111.84 82.64,112.56 100.36,112.56 103.93,108.99 103.93,107.19 104.92,106.19 IC4.6
40XX_CH_D_OUT
  Top 0.305: U$10.6 77.37,115.72 77.62,115.47 77.62,112.93 76.81,112.11 72.61,112.11 71.73,111.23 71.73,107.64 IC1.11 SV2.3 SV6.3 82.7,105.56 82.84,105.69 82.84,111.47 83.01,111.65 99.98,111.65 103.02,108.61 103.02,105.56 104.92,103.66 IC4.4
40XX_CH_E_IN_A
  Top 0.305: U$11.1 62.63,86.51 59.84,83.72 SV7.6 | SV7.6 SV3.6 IC3.1 | SV7.6 58.32,78.89 58.21,78.99 58.21,79.96 57.35,80.82 39.04,80.82 35.2,76.98 IC5.1
40XX_CH_E_IN_B
  Top 0.305: U$11.2 62.63,85.24 61.36,83.97 61.36,80.67 62.18,79.86 67.25,79.86 67.82,79.29 67.82,77.98 IC3.2 SV3.5 SV7.5 58.32,76.35 57.76,76.91 57.76,79.77 57.16,80.36 39.84,80.36 35.19,75.72 IC5.2
40XX_CH_E_OUT
  Top 0.305: U$11.3 62.63,83.97 61.82,83.16 61.82,80.87 62.38,80.31 67.44,80.31 68.27,79.48 68.27,75.89 IC3.3 SV3.4 SV7.4 58.32,73.81 57.3,74.83 57.3,79.58 56.98,79.91 40.66,79.91 35.2,74.44 IC5.3
40XX_CH_F_IN_A
  Top 0.305: U$11.7 67.21,82.7 69.19,80.72 69.19,71.73 IC3.5 SV3.2 SV7.2 58.32,68.73 57.76,68.17 57.76,65.31 57.16,64.72 40.35,64.72 36.98,68.08 36.98,70 35.08,71.91 IC5.5
40XX_CH_F_IN_B  (via drill 0.35)
  Top 0.305: IC3.6 SV3.1 SV7.1 58.57,66.19 58.21,65.83 58.21,65.12 57.35,64.26 40.16,64.26 36.52,67.89 36.52,69.19 35.08,70.64 IC5.6 | v65.2,81.2 65.43,81.43 65.43,83.72 65.68,83.97 U$11.8
  Bottom 0.305: v65.2,81.2 66.69,81.2 68.4,79.49 68.4,67.83 66.8,66.23 66.23,66.23 IC3.6
40XX_CH_F_OUT
  Top 0.305: U$11.6 67.21,81.43 68.73,79.91 68.73,73.81 IC3.4 SV3.3 SV7.3 58.32,71.27 57.3,70.25 57.3,65.5 56.99,65.19 56.04,65.19 56.03,65.17 40.54,65.17 37.62,68.09 37.62,70.64 35.08,73.17 IC5.4
40XX_CH_G_IN_A
  Top 0.305: U$20.1 72.79,86.51 70.36,84.07 70.36,67.1 IC3.8 SV4.6 SV8.6 81.92,63.65 81.92,62.45 83.36,61.01 100.38,61.01 104.92,65.56 IC6.1
40XX_CH_G_IN_B
  Top 0.305: U$20.2 72.79,85.24 70.81,83.26 70.81,69.19 IC3.9 SV4.5 SV8.5 82.06,66.19 82.38,65.88 82.38,62.63 83.55,61.47 99.57,61.47 104.92,66.83 IC6.2
40XX_CH_G_OUT
  Top 0.305: U$20.3 72.79,83.97 71.27,82.45 71.27,71.27 IC3.10 SV4.4 SV8.4 82.7,68.73 82.84,68.59 82.84,62.82 83.74,61.92 98.75,61.92 104.92,68.09 IC6.3
40XX_CH_H_IN_A
  Top 0.305: U$20.7 77.37,82.7 78.13,81.94 78.13,78.13 77.31,77.31 72.75,77.31 72.18,76.75 72.18,75.44 IC3.12 SV4.2 SV8.2 82.06,73.81 82.38,74.12 82.38,77.37 82.82,77.81 99.66,77.81 103.02,74.46 103.02,72.54 104.92,70.64 IC6.5
40XX_CH_H_IN_B
  Top 0.305: U$20.8 77.37,83.97 80.16,81.18 SV8.1 | SV8.1 SV4.1 IC3.13 | IC6.6 104.92,71.91 103.66,73.17 103.66,74.47 99.85,78.27 82.64,78.27 81.92,77.56 81.92,76.84 81.43,76.35 SV8.1
40XX_CH_H_OUT
  Top 0.305: U$20.6 77.37,81.43 77.67,81.12 77.67,79.14 76.3,77.77 72.56,77.77 71.73,76.94 71.73,73.35 IC3.11 SV4.3 SV8.3 82.7,71.27 82.84,71.41 82.84,77.18 83.01,77.36 99.47,77.36 102.38,74.44 102.38,70.64 103.66,69.36 IC6.4
GND  (via drill 0.35)  (28 unrouted)
  Top 0.305: JP8.2 52.22,20.47 56.16,24.41 C4.2 C3.2 | IC10.1 67.26,35.58 C2.1 | IC5.8 33.91,67.74 v34.95,66.7 | IC12.12 v65.43,90.57 | v64.49,55.45 64.64,55.29 IC7.8 65.56,53.11 v65.17,52.73 | IC6.8 102.42,78.12 v101.24,78.12
  Bottom 0.305: v47.38,37.28 46.4,38.26 46.4,41.46 54.87,49.93 62.38,49.93 63.72,51.27 63.72,51.31 64.12,51.71 64.16,51.71 v65.17,52.73
LDR_CH_A_+  (via drill 0.35)  (2 unrouted)
  Top 0.305: 18.98,100.76 PH1.2 | v45.77,122.81 47.48,124.52 67.37,124.52 IC11.5 | v42,119.03 39.02,116.06 36.17,116.06 21.54,101.43 21.54,100.86
  Bottom 0.305: v42,119.03 v45.77,122.81
LDR_CH_A_OUT
  Top 0.305: SV9.3 23.38,117.91 32.85,127.38 35.02,127.38 38.11,124.29 38.8,124.29 42.92,128.42 IC11.2
LDR_CH_B_+  (2 unrouted)
LDR_CH_B_OUT  (via drill 0.35)
  Top 0.305: IC11.1 43.16,129.69 v38.45,124.98
  Bottom 0.305: v38.45,124.98 35.71,124.98 32.51,121.78 27.25,121.78 25.18,119.7 SV9.4
LDR_CH_C+  (2 unrouted)
LDR_CH_C_OUT
  Top 0.305: IC11.14 97.69,129.69 98.92,130.92 100.75,130.92 104.29,127.38 106.92,127.38 114.82,119.48 SV10.3
LDR_CH_D+  (2 unrouted)
LDR_CH_D_OUT  (via drill 0.35)
  Top 0.305: v103.83,125.44 101.09,125.44 98.11,128.42 IC11.13
  Bottom 0.305: SV10.4 116.62,117.91 109.86,124.67 104.6,124.67 v103.83,125.44
LDR_CH_E+  (2 unrouted)
LDR_CH_E_OUT  (via drill 0.35)
  Top 0.305: v74.34,88.86 74,89.2 72.63,89.2 IC12.2
  Bottom 0.305: v74.34,88.86 74.34,84.97 87.14,72.17 87.14,54.65 SV11.3
LDR_CH_F+  (2 unrouted)
LDR_CH_F_OUT  (via drill 0.35)
  Top 0.305: v72.06,87.14 72.52,87.6 72.52,87.94 IC12.1
  Bottom 0.305: v72.06,87.14 72.06,79.83 71.6,79.37 71.6,63.83 79.94,55.48 82.23,55.48 107.59,30.12 108.08,30.12 SV11.4
LDR_CH_G+  (2 unrouted)
LDR_CH_G_OUT  (via drill 0.35)
  Top 0.305: v65.66,87.6 66,87.94 67.37,87.94 IC12.14
  Bottom 0.305: v65.66,87.6 52.86,74.8 52.86,63.83 18.04,29.01 18.04,27.44 23.23,22.25 24.04,22.25 SV12.3
LDR_CH_H+  (2 unrouted)
LDR_CH_H_OUT  (via drill 0.35)
  Top 0.305: v31.25,41.08 31.25,76.17 36.4,81.32 51.71,81.32 59.6,89.2 67.37,89.2 IC12.13
  Bottom 0.305: v31.25,41.08 31.25,38.11 20.03,26.89 20.03,26.13 20.98,25.18 SV12.4
LED_CH_A_IN  (via drill 0.35)
  Top 0.305: v32.28,103.6 33.88,103.6 IC2.7
  Bottom 0.305: SV9.2 21.54,112.98 30.91,103.6 v32.28,103.6
LED_CH_A_OUT  (via drill 0.35)
  Top 0.305: v41.65,103.83 41.54,103.72 40.05,103.72 IC2.10 | v31.25,104.29 27.25,104.29 21.54,98.58 11.71,98.58 10.79,99.49 LED_A.K
  Bottom 0.305: v31.25,104.29 41.2,104.29 v41.65,103.83
LED_CH_B_IN  (via drill 0.35)
  Top 0.305: v107.72,107.49 106.12,107.49 IC4.7
  Bottom 0.305: v107.72,107.49 93.32,107.49 83.83,116.98 28.51,116.98 27.02,118.46 SV9.5
LED_CH_B_OUT  (via drill 0.35)
  Top 0.305: v101.78,108.18 101.78,107.72 101.55,107.49 99.95,107.49 IC4.10
  Bottom 0.305: v101.78,108.18 95.38,108.18 74.23,129.32 40.51,129.32 LED_B.K
LED_CH_C_IN  (via drill 0.35)
  Top 0.305: IC5.7 35.08,69.36 35.14,69.31 35.37,69.31 v35.48,69.2
  Bottom 0.305: v35.48,69.2 35.48,72.06 52.86,89.43 60.06,89.43 67.03,96.4 101.2,96.4 112.52,107.72 112.52,117.89 112.98,118.35 SV10.2
LED_CH_C_OUT  (via drill 0.35)
  Top 0.305: v38.23,75.83 38.23,70 38.8,69.43 40.05,69.43 IC5.10 | v58.91,118.12 v57.08,116.29 | v75.83,126.69 96.97,126.69 v97.89,127.61
  Bottom 0.305: v38.23,75.83 38.57,75.83 52.63,89.89 53.88,89.89 54.8,90.8 54.8,114 v57.08,116.29 | v58.91,118.12 65.54,124.75 73.89,124.75 v75.83,126.69 | v97.89,127.61 99.49,129.21 LED_C.K
LED_CH_D_IN  (via drill 0.35)
  Top 0.305: v107.72,73.43 107.49,73.2 106.23,73.2 IC6.7
  Bottom 0.305: v107.72,73.43 107.72,88.75 113.55,94.58 113.55,108.06 118.46,112.98 SV10.5
LED_CH_D_OUT  (via drill 0.35)
  Top 0.305: v101.55,73.54 101.2,73.2 99.95,73.2 IC6.10 | v112.86,94.92 116.41,98.46 128.18,98.46 129.21,99.49 LED_D.K
  Bottom 0.305: v101.55,73.54 102.31,74.31 102.31,84.36 v112.86,94.92
LED_CH_E_IN  (via drill 0.35)
  Top 0.305: v91.83,53.54 90.12,55.26 74.46,55.26 IC7.1
  Bottom 0.305: SV11.2 91.85,53.54 v91.83,53.54
LED_CH_F_IN  (via drill 0.35)
  Top 0.305: v73.66,53.66 73.2,54.11 73.2,55.26 IC7.2
  Bottom 0.305: SV11.5 80.96,53.66 v73.66,53.66
LED_CH_G_IN  (via drill 0.35)
  Top 0.305: v71.49,53.66 71.94,54.11 71.94,55.26 IC7.3
  Bottom 0.305: v71.49,53.66 69.66,53.66 69.43,53.88 68.29,53.88 37.42,23.02 28.51,23.02 27.02,21.54 SV12.2
LED_CH_H_IN  (via drill 0.35)
  Top 0.305: v64.4,51.03 67.94,51.03 70.57,53.66 70.57,55.26 IC7.4
  Bottom 0.305: v64.4,51.03 64.4,50.68 40.28,26.57 35.96,26.57 35.56,26.97 SV12.5
MOTOR_A_FWD  (via drill 0.35)
  Top 0.305: IC8.4 91.74,27.45 v91.37,27.82
  Bottom 0.305: SV13.1 91.37,30.59 v91.37,27.82
MOTOR_A_REV  (via drill 0.35)
  Top 0.305: IC8.5 97,27.45 v96.63,27.82
  Bottom 0.305: v96.63,27.82 96.63,28.05 76.86,47.83 76.02,47.83 SV13.2
MOTOR_A_VREF  (1 unrouted)
  Top 0.305: IC8.6 96.54,28.73 95.4,29.87
MOTOR_B_FWD  (via drill 0.35)
  Top 0.305: v64.28,43.48 62.11,43.48 49.9,31.27 IC9.4
  Bottom 0.305: SV13.5 66.06,45.49 66.06,45.26 v64.28,43.48
MOTOR_B_REV
  Top 0.305: IC9.5 42.11,31.37 42.11,33.08 43.71,34.68 51.83,34.68 62.46,45.31 63.37,45.31 63.6,45.54 SV13.6
MOTOR_B_VREF  (1 unrouted)
  Top 0.305: IC9.6 43.2,29.99 44.6,31.39
N$1  (1 unrouted)
  Top 0.305: 95.4,37.27 R8.2
N$3  (1 unrouted)
  Top 0.305: 44.6,37.27 R9.2
N$5  (via drill 0.35)
  Top 0.305: IC2.16 v42.06,111.28 | D6.C v51.59,113.18
  Bottom 0.305: v42.06,111.28 49.68,111.28 v51.59,113.18
N$6
  Top 0.305: IC9.1 49.71,24.95 U$2.P$2
N$7
  Top 0.305: U$2.P$1 43.97,24.16 43.97,27.45 42.7,28.73 IC9.7
N$8  (via drill 0.35)
  Top 0.305: IC2.15 v42.06,110 | D5.C v51.59,110.64
  Bottom 0.305: v42.06,110 50.95,110 v51.59,110.64
N$9  (via drill 0.35)
  Top 0.305: IC2.14 v42.06,108.73 | D4.C v51.59,108.1
  Bottom 0.305: v42.06,108.73 50.95,108.73 v51.59,108.1
N$10  (via drill 0.35)
  Top 0.305: IC2.13 v42.06,107.47 | D3.C v51.59,105.56
  Bottom 0.305: v42.06,107.47 49.68,107.47 v51.59,105.56
N$11  (via drill 0.35)
  Top 0.305: IC2.12 v42.06,106.19 | D2.C v51.59,103.02
  Bottom 0.305: v42.06,106.19 48.41,106.19 v51.59,103.02
N$12  (via drill 0.35)
  Top 0.305: IC2.11 v42.06,104.92 | D1.C v51.59,100.48
  Bottom 0.305: v42.06,104.92 47.14,104.92 v51.59,100.48
N$13  (via drill 0.35)
  Top 0.305: IC6.16 v97.94,65.56 | D26.C v88.41,63.65
  Bottom 0.305: v97.94,65.56 90.32,65.56 v88.41,63.65
N$14  (via drill 0.35)
  Top 0.305: IC4.16 v97.94,99.84 | D12.C v88.41,97.94
  Bottom 0.305: v97.94,99.84 90.32,99.84 v88.41,97.94
N$15  (via drill 0.35)
  Top 0.305: IC4.15 v97.94,101.11 | D11.C v88.41,100.48
  Bottom 0.305: v97.94,101.11 89.05,101.11 v88.41,100.48
N$16  (via drill 0.35)
  Top 0.305: IC4.14 v97.94,102.38 | D10.C v88.41,103.02
  Bottom 0.305: v97.94,102.38 89.05,102.38 v88.41,103.02
N$17  (via drill 0.35)
  Top 0.305: IC4.13 v97.94,103.66 | D9.C v88.41,105.56
  Bottom 0.305: v97.94,103.66 90.32,103.66 v88.41,105.56
N$18  (via drill 0.35)
  Top 0.305: IC4.12 v97.94,104.92 | D8.C v88.41,108.1
  Bottom 0.305: v97.94,104.92 91.59,104.92 v88.41,108.1
N$19  (via drill 0.35)
  Top 0.305: IC4.11 v97.94,106.19 | D7.C v88.41,110.64
  Bottom 0.305: v97.94,106.19 92.86,106.19 v88.41,110.64
N$20  (3 unrouted)
N$21  (via drill 0.35)
  Top 0.305: IC6.14 v97.94,68.09 | D24.C v88.41,68.73
  Bottom 0.305: v97.94,68.09 89.05,68.09 v88.41,68.73
N$23  (via drill 0.35)
  Top 0.305: IC5.16 v42.06,76.98 | D20.C v51.59,78.89
  Bottom 0.305: v42.06,76.98 49.68,76.98 v51.59,78.89
N$24  (3 unrouted)
N$25  (via drill 0.35)
  Top 0.305: IC5.15 v42.06,75.72 | D19.C v51.59,76.35
  Bottom 0.305: v51.59,76.35 50.95,75.72 v42.06,75.72
N$27  (via drill 0.35)
  Top 0.305: IC5.14 v42.06,74.44 | D18.C v51.59,73.81
  Bottom 0.305: v51.59,73.81 50.95,74.44 v42.06,74.44
N$29  (via drill 0.35)
  Top 0.305: IC5.13 v42.06,73.17 | D17.C v51.59,71.27
  Bottom 0.305: v51.59,71.27 49.68,73.17 v42.06,73.17
N$31  (via drill 0.35)
  Top 0.305: IC5.12 v42.06,71.91 | D16.C v51.59,68.73
  Bottom 0.305: v51.59,68.73 48.41,71.91 v42.06,71.91
N$32  (via drill 0.35)
  Top 0.305: IC5.11 v42.06,70.64 | D15.C v51.59,66.19
  Bottom 0.305: v51.59,66.19 47.14,70.64 v42.06,70.64
N$33  (via drill 0.35)
  Top 0.305: IC6.15 v97.94,66.83 | D25.C v88.41,66.19
  Bottom 0.305: v97.94,66.83 89.05,66.83 v88.41,66.19
N$34  (via drill 0.35)
  Top 0.305: IC6.13 v97.94,69.36 | D23.C v88.41,71.27
  Bottom 0.305: v97.94,69.36 90.32,69.36 v88.41,71.27
N$35  (via drill 0.35)
  Top 0.305: IC6.12 v97.94,70.64 | D22.C v88.41,73.81
  Bottom 0.305: v97.94,70.64 91.59,70.64 v88.41,73.81
N$38  (via drill 0.35)
  Top 0.305: IC6.11 v97.94,71.91 | D21.C v88.41,76.35
  Bottom 0.305: v97.94,71.91 92.86,71.91 v88.41,76.35
N$44  (via drill 0.35)
  Top 0.305: v66.57,58.11 67.37,58.11 U$4.1 | v48.86,58.11 45.88,58.11 40.74,63.26 v40.4,63.26
  Bottom 0.305: v48.86,58.11 v66.57,58.11 | v40.4,63.26 25.54,78.11 25.54,96.52 20.68,101.38 LED_A.A
N$45  (via drill 0.35)
  Top 0.305: v65.66,57.31 66.11,57.31 66.34,57.08 67.94,57.08 68.63,57.77 68.63,58 U$4.2 | v48.05,57.31 46,57.31 40.74,62.57 36.74,62.57 31.94,67.37 v31.94,75.83
  Bottom 0.305: v48.05,57.31 v65.66,57.31 | v31.94,75.83 31.94,96.97 17.77,111.15 17.77,112.98 27.22,122.43 27.94,122.43 33.01,127.49 38.57,127.49 LED_B.A
N$46  (via drill 0.35)
  Top 0.305: v94.8,51.6 92.4,49.2 74.46,49.2 IC7.16
  Bottom 0.305: v94.8,51.6 96.97,51.6 111.6,36.97 128.18,36.97 129.32,38.11 129.32,40.4 LED_E.K
N$47  (via drill 0.35)
  Top 0.305: IC7.15 73.2,49.08 73.2,47.9 72.52,47.22 v72.52,44.17
  Bottom 0.305: LED_F.K 99.49,10.79 98.46,11.82 98.46,19.02 85.55,31.94 84.75,31.94 v72.52,44.17
N$48  (via drill 0.35)
  Top 0.305: v68.17,43.25 69.09,43.25 70.23,44.4 70.23,46.68 70.91,47.37 71.37,47.37 71.94,47.94 71.94,49.08 IC7.14
  Bottom 0.305: LED_G.K 40.42,15.5 v68.17,43.25
N$49  (via drill 0.35)
  Top 0.305: v65.66,42.34 67.26,43.94 68.51,43.94 68.63,43.83 68.97,43.83 69.77,44.62 69.77,46.91 70.57,47.71 70.57,49.08 IC7.13 | v58.46,42.34 56.74,42.34 53.58,39.18 47.67,39.18 46.09,40.76 43.04,40.76 42.68,40.4 v23.71,40.4
  Bottom 0.305: v58.46,42.34 v65.66,42.34 | v23.71,40.4 10.79,40.4 LED_H.K
N$50  (via drill 0.35)
  Top 0.305: v93.77,58.91 75.49,58.91 73.2,56.63 70.42,56.63 70,57.05 U$4.3 | v97.66,62.8 99.26,64.4 v99.72,64.4
  Bottom 0.305: v97.66,62.8 v93.77,58.91 | v99.72,64.4 114,78.69 114,102.92 122.23,111.15 122.23,112.98 109.55,125.66 | 109.55,125.66 107.95,125.66 106.12,127.49 101.43,127.49 LED_C.A | 109.55,125.66
N$51  (via drill 0.35)
  Top 0.305: v99.03,60.28 90.75,60.28 90.07,59.6 75.49,59.6 72.97,57.08 71.27,57.08 U$4.4
  Bottom 0.305: v99.03,60.28 99.03,62.69 114.46,78.11 114.46,96.52 118.12,100.17 126.35,100.17 127.49,101.32 LED_D.A
N$52  (via drill 0.35)
  Top 0.305: U$4.6 72.63,61.09 81.89,61.09 82.69,60.28 v88.97,60.28
  Bottom 0.305: v88.97,60.28 109.43,39.83 126.35,39.83 127.49,38.68 LED_E.A
N$53  (via drill 0.35)
  Top 0.305: v72.97,59.48 72.63,59.48 71.37,60.74 71.37,61.09 U$4.7
  Bottom 0.305: v72.97,59.48 72.97,52.63 107.38,18.22 108.63,18.22 109.66,17.19 109.66,16.05 106.12,12.51 101.43,12.51 LED_F.A
N$54  (via drill 0.35)
  Top 0.305: v70,62.23 U$4.8 | v63.03,47.6 v63.03,53.31
  Bottom 0.305: v70,62.23 70,60.28 66.22,56.51 63.5,56.51 63.03,56.03 v63.03,53.31 | v63.03,47.6 62.69,47.6 46.45,31.37 46.45,22.22 38.62,14.39 LED_G.A
N$55  (via drill 0.35)
  Top 0.305: v46.8,58.8 63.14,58.8 66.57,62.23 68.39,62.23 68.74,61.87 68.74,61.2 U$4.9
  Bottom 0.305: v46.8,58.8 46.8,58.46 27.02,38.68 12.51,38.68 LED_H.A
N$61
  Top 0.61: JP8.1 54.76,20.22 59.84,25.3 D13.A
N$82
  Top 0.305: U$1.P$2 94.13,26.25 94.13,30.63 93.5,31.27 IC8.1
N$83
  Top 0.305: U$1.P$1 98.06,26.19 99.21,26.19 99.84,26.82 99.84,29.36 99.21,29.99 IC8.7
OUTPUT_A_IN  (via drill 0.35)
  Top 0.305: v68.06,52.17 68.06,55.26 IC7.6
  Bottom 0.305: v68.06,52.17 68.06,47.37 68.63,46.8 68.63,45.65 SV13.4
OUTPUT_A_OUT  (via drill 0.35)
  Top 0.305: v70.91,52.86 70.46,52.86 68.06,50.45 68.06,49.2 IC7.11 | JP1.1 42.06,55.08 v43.94,53.2
  Bottom 0.305: v70.91,52.86 71.71,52.86 72.17,53.31 72.17,54 71.83,54.34 65.08,54.34 63.37,52.63 44.51,52.63 v43.94,53.2
OUTPUT_B_IN  (via drill 0.35)
  Top 0.305: v69.09,53.2 69.43,53.54 69.43,55.26 IC7.5
  Bottom 0.305: v69.09,53.2 69.09,48.51 71.26,46.34 71.26,45.65 SV13.3
OUTPUT_B_OUT  (via drill 0.35)
  Top 0.305: v94.8,55.48 91.49,52.17 70.8,52.17 69.31,50.68 69.31,49.2 IC7.12
  Bottom 0.305: v94.8,55.48 95.95,55.48 96.17,55.71 96.29,55.71 96.52,55.94 97.89,55.94 JP2.1
RES_D1
  Top 0.305: D1.A 54.99,99.21 51.59,99.21 47.37,103.42 U$19.6
RES_D2
  Top 0.305: D2.A 54.99,101.75 51.59,101.75 47.77,105.56 U$19.7
RES_D3
  Top 0.305: D3.A 54.99,104.29 51.59,104.29 49.05,106.83 U$19.8
RES_D4
  Top 0.305: D4.A 54.99,106.83 51.59,106.83 47.47,110.94 44.91,110.94 44.35,110.39 44.35,109.39 U$19.1
RES_D5
  Top 0.305: D5.A 54.99,109.37 51.59,109.37 49.55,111.4 44.23,111.4 43.28,110.45 43.28,108.41 43.58,108.1 U$19.2
RES_D6
  Top 0.305: D6.A 54.99,111.91 44.09,111.91 42.82,110.64 42.82,107.34 43.33,106.83 U$19.3
RES_D7
  Top 0.305: D7.A 85.01,109.37 89.3,109.37 91.84,106.83 U$5.6
RES_D8
  Top 0.305: D8.A 85.01,106.83 90.57,106.83 91.84,105.56 U$5.7
RES_D9
  Top 0.305: D9.A 85.01,104.29 U$5.8
RES_D10
  Top 0.305: D10.A 85.01,101.75 88.41,101.75 89.18,100.99 95.65,100.99 95.65,101.73 U$5.1
RES_D11
  Top 0.305: D11.A 85.01,99.21 94.83,99.21 96.8,101.18 96.8,102.64 96.42,103.02 U$5.2
RES_D12
  Top 0.305: D12.A 85.01,96.67 92.94,96.67 97.26,100.99 97.26,103.45 96.42,104.29 U$5.3
RES_D15  (via drill 0.35)
  Top 0.305: v47.37,69.09 U$6.6 | v51.48,63.48 51.71,63.26 53.77,63.26 v54,63.48 | v55.03,65.89 55.94,65.89 56.17,66.11 D15.A
  Bottom 0.305: v47.37,69.09 47.37,67.6 v51.48,63.48 | v54,63.48 54,64.86 v55.03,65.89
RES_D16
  Top 0.305: D16.A 54.99,67.46 51.59,67.46 47.77,71.27 U$6.7
RES_D17
  Top 0.305: D17.A 54.99,70 51.59,70 49.05,72.54 U$6.8
RES_D18
  Top 0.305: D18.A 54.99,72.54 51.59,72.54 48.03,76.1 44.85,76.1 44.37,75.61 U$6.1
RES_D19
  Top 0.305: D19.A 56.26,76.07 55.27,75.08 51.71,75.08 49.93,76.86 43.84,76.86 43.33,76.35 43.33,74.06 43.58,73.81 U$6.2
RES_D20
  Top 0.305: D20.A 54.99,77.62 43.58,77.62 42.82,76.86 42.82,73.3 43.58,72.54 U$6.3
RES_D21
  Top 0.305: D21.A 85.01,75.08 89.3,75.08 91.84,72.54 U$9.6
RES_D22
  Top 0.305: D22.A 85.01,72.54 90.57,72.54 91.84,71.27 U$9.7
RES_D23
  Top 0.305: D23.A 85.01,70 U$9.8
RES_D24
  Top 0.305: D24.A 85.01,67.46 88.41,67.46 89.18,66.7 95.4,66.7 95.63,66.93 U$9.1
RES_D25
  Top 0.305: D25.A 85.01,64.92 95.91,64.92 96.8,65.81 96.8,68.35 96.42,68.73 U$9.2
RES_D26
  Top 0.305: D26.A 85.01,62.38 94.64,62.38 97.26,65 97.26,69.16 96.42,70 U$9.3
VBAT
  Top 0.61: D13.C 61.55,31.71 63.9,29.36 68.11,29.36 U$7.COM
VDD  (via drill 0.35)  (23 unrouted)
  Top 0.305: IC1.14 73.81,115.49 U$10.5 74.57,115.72 75.08,116.23 75.08,120.29 75.59,120.8 U$10.10 | U$3.5 64.41,115.72 64.92,116.23 64.92,116.29 | 64.92,116.29 64.92,120.29 65.43,120.8 U$3.10 66.57,120.86 68.74,120.86 69.31,121.44 69.31,126.39 68.55,127.15 IC11.3 | U$11.5 64.41,81.43 64.92,81.94 64.92,86 65.43,86.51 U$11.10 66.57,86.57 68.51,86.57 70.69,88.75 70.69,90.57 | 20.43,110.59 SV9.1 PH1.1 | 27.62,114.77 27.62,116.57 28.77,117.72 SV9.6 | 110.59,119.57 SV10.1 | SV10.6 117.91,111.23 117.14,112 | SV11.6 111.23,22.28 112,23.05 | 116.45,28.77 SV11.1 | SV12.6 22.09,28.77 22.86,28 | 29.41,20.43 SV12.1 | IC10.2 70.03,36.45 69.81,36.66 | C2.2 68.09,38.38 69.81,36.66 | 90.69,28.73 88.55,28.73 C6.1 87.03,27.37 84.4,29.99 82.8,29.99 82.12,30.68 82.12,33.2 82.74,33.82 | 90.69,28.73 IC8.3 | U$9.10 92.63,67.48 93.43,67.48 94.23,68.29 94.23,71.94 94.92,72.63 95.6,72.63 U$9.5 95.72,72.52 96.4,72.52 98.17,74.29 | 98.17,74.29 98.35,74.46 IC6.9 | JP2.2 97.43,58.57 95.49,56.63 95.49,42.23 R8.1 95.26,42.23 94.92,41.88 94.12,41.88 90.92,38.68 87.6,38.68 82.74,33.82 | v98.23,74.23 98.17,74.29 | 90.69,28.73 v90.69,28.51 | 41.83,68.69 41.2,68.06 40.05,68.06 IC5.9 | 41.83,68.69 43.14,70 U$6.5 45.31,70 45.77,70.46 45.77,74.57 46.23,75.03 47.37,75.03 U$6.10 | 44.62,54 44.62,56.51 42.57,58.57 JP1.2 | 44.62,54 44.62,42.23 R9.1 | v41.77,68.74 41.83,68.69 | C2.2 64.86,38.34 64.51,38 58.46,38 53.43,32.97 53.43,31.94 C4.1 51.45,29.99 IC9.3 47.14,30.11 46.45,30.11 46.23,29.88 46.11,29.88 v45.77,29.54 | 68.06,59.71 71.71,59.71 72.52,58.91 72.52,58.11 U$4.5 | 67.89,59.88 67.48,60.28 67.48,61.09 U$4.10
  Top 0.305: 67.89,59.88 68.06,59.71 | 63.71,54 63.71,56.4 67.03,59.71 67.71,59.71 | 63.71,54 63.71,50.68 65.25,49.15 IC7.9 65.54,49.08 64.97,48.51 64.97,38.45 C2.2 | 67.89,59.88 67.71,59.71 | 63.71,54 44.62,54 | 82.74,33.82 76.4,40.17 73.31,40.17 69.81,36.66 | 98.35,108.75 99.95,108.75 IC4.9 | 98.35,108.75 96.4,106.81 95.72,106.81 U$5.5 95.6,106.92 94.92,106.92 94.23,106.23 94.23,102.58 93.43,101.78 92.63,101.78 U$5.10 92.52,101.78 91.14,101.78 v89.32,103.6 | v98.35,108.86 98.35,108.75 | v64.86,116.29 64.92,116.29 | IC2.9 40.05,102.35 41.2,102.35 v41.77,102.92 43.14,104.29 U$19.5 45.31,104.29 45.77,104.75 45.77,108.86 46.23,109.32 47.37,109.32 U$19.10 | IC3.14 73.77,78.91 73.77,81.32 U$20.5 74.57,81.43 75.08,81.94 75.08,86 75.59,86.51 U$20.10 76.4,86.57 76.4,88.4 74.23,90.57 IC12.3 70.69,90.57 | 58.68,91.6 60.86,91.6 66,96.75 68.86,96.75 | 69.83,95.78 70.69,94.92 70.69,90.57 | 69.83,95.78 68.86,96.75 | 90.19,91.59 87.44,94.35 76.4,94.35 74,96.75 71.6,96.75 | 70.8,96.75 71.6,96.75 | 69.83,95.78 70.8,96.75 | 71.6,96.75 v71.6,97.09 | 68.86,96.75 70.8,96.75 | 67.71,59.71 68.06,59.71
  Bottom 0.305: JP2.2 98,58.57 98.35,58.91 98.35,64.06 99.15,64.86 99.15,72.4 98.23,73.31 v98.23,74.23 98.23,87.6 95.49,90.34 95.49,91.49 | 108.06,16.74 107.49,16.74 97.09,27.14 91.03,27.14 90.69,27.48 v90.69,28.51 | v41.77,68.74 41.65,68.74 41.65,58.91 42,58.57 JP1.2 | v98.35,108.86 98.35,119.61 101.32,122.58 107.27,122.58 | v64.86,116.29 64.97,116.41 69.89,116.41 72.11,114.18 | 72.11,114.18 73.09,113.2 73.77,113.2 IC1.14 73.89,113.09 75.03,113.09 75.72,112.41 81.2,112.41 82.34,111.26 82.34,109.89 87.83,104.4 88.17,104.4 88.4,104.18 88.52,104.29 88.86,104.29 89.43,103.72 v89.32,103.6 | 53.43,91.6 53.43,92.29 42.8,102.92 v41.77,102.92 28.51,102.92 20.28,111.15 19.82,111.15 SV9.1 | 72.11,114.18 71.6,113.66 v71.6,97.09 | 32.86,16.63 v45.77,29.54
VIN  (via drill 0.35)
  Top 0.305: IC10.3 72.79,35.58 C1.2 | IC8.2 88.55,29.99 C5.1 86.57,31.82 85.77,31.82 v85.2,31.25 | IC9.2 51.45,28.73 C3.1 53.43,26.91 54.23,26.91 v54.8,27.48
  Top 0.61: U$7.NC 72,34.79 IC10.3
  Bottom 0.305: v54.8,27.48 68.29,27.48 70.97,30.17 | 70.97,30.17 72.06,31.25 U$7.NC 73.6,29.65 | v85.2,31.25 76.29,31.25 74.69,29.65 74.57,29.65 73.6,29.65 | 73.6,29.65 71.49,29.65 70.97,30.17

### Text on the board
Document: Battle Bits PCB V3.0 | Comparator | Designed by / Jelle Reith / July 2021 | Logic Gate | 1 | 14 | VDD | 2 | 13 | 3 | 12 | 4 | 11 | 5 | 10 | 6 | 9 | GND | 7 | 8 | Transistor Array | Transistor Array | Comparator | Resistor Array | Resistor Array | GND / Logic 0 | VDD / Logic 1 | VDD / Logic 1 | GND / Logic 0 | Logic Gate | 1 | 14 | VDD | 2 | 13 | 3 | 12 | 4 | 11 | 5 | 10 | 6 | 9 | GND | 7 | 8 | Output A | Output B | + | + | MAX 500 mA | MAX 500 mA | - | - | Output A | Output B | L MOTOR REV | R MOTOR FWD | L MOTOR FWD | R MOTOR REV | H-Bridge motor driver | H-Bridge motor driver | 0 | 1 | -V_BAT | +V_BAT
_bsilk: Battle Bits PCB V3.0 | Designed by / Jelle Reith / July 2021 | github.com/battlebitsworkshop/battlebitsworkshop | jellereith.nl / iboibelings.nl | Black wire | Red wire